# EasyEDA Pro project 2230506226.epro

# Schematic SCH

## Sheets
1 P1: Board Name: B1; Create Date: 2024-03-08; Page Name: P1; Project Name: 2230506226; Schematic Name: SCH; Update Date: 2024-04-02; Company: EDA设计与开发; Page Size: A4; Version: V1.0
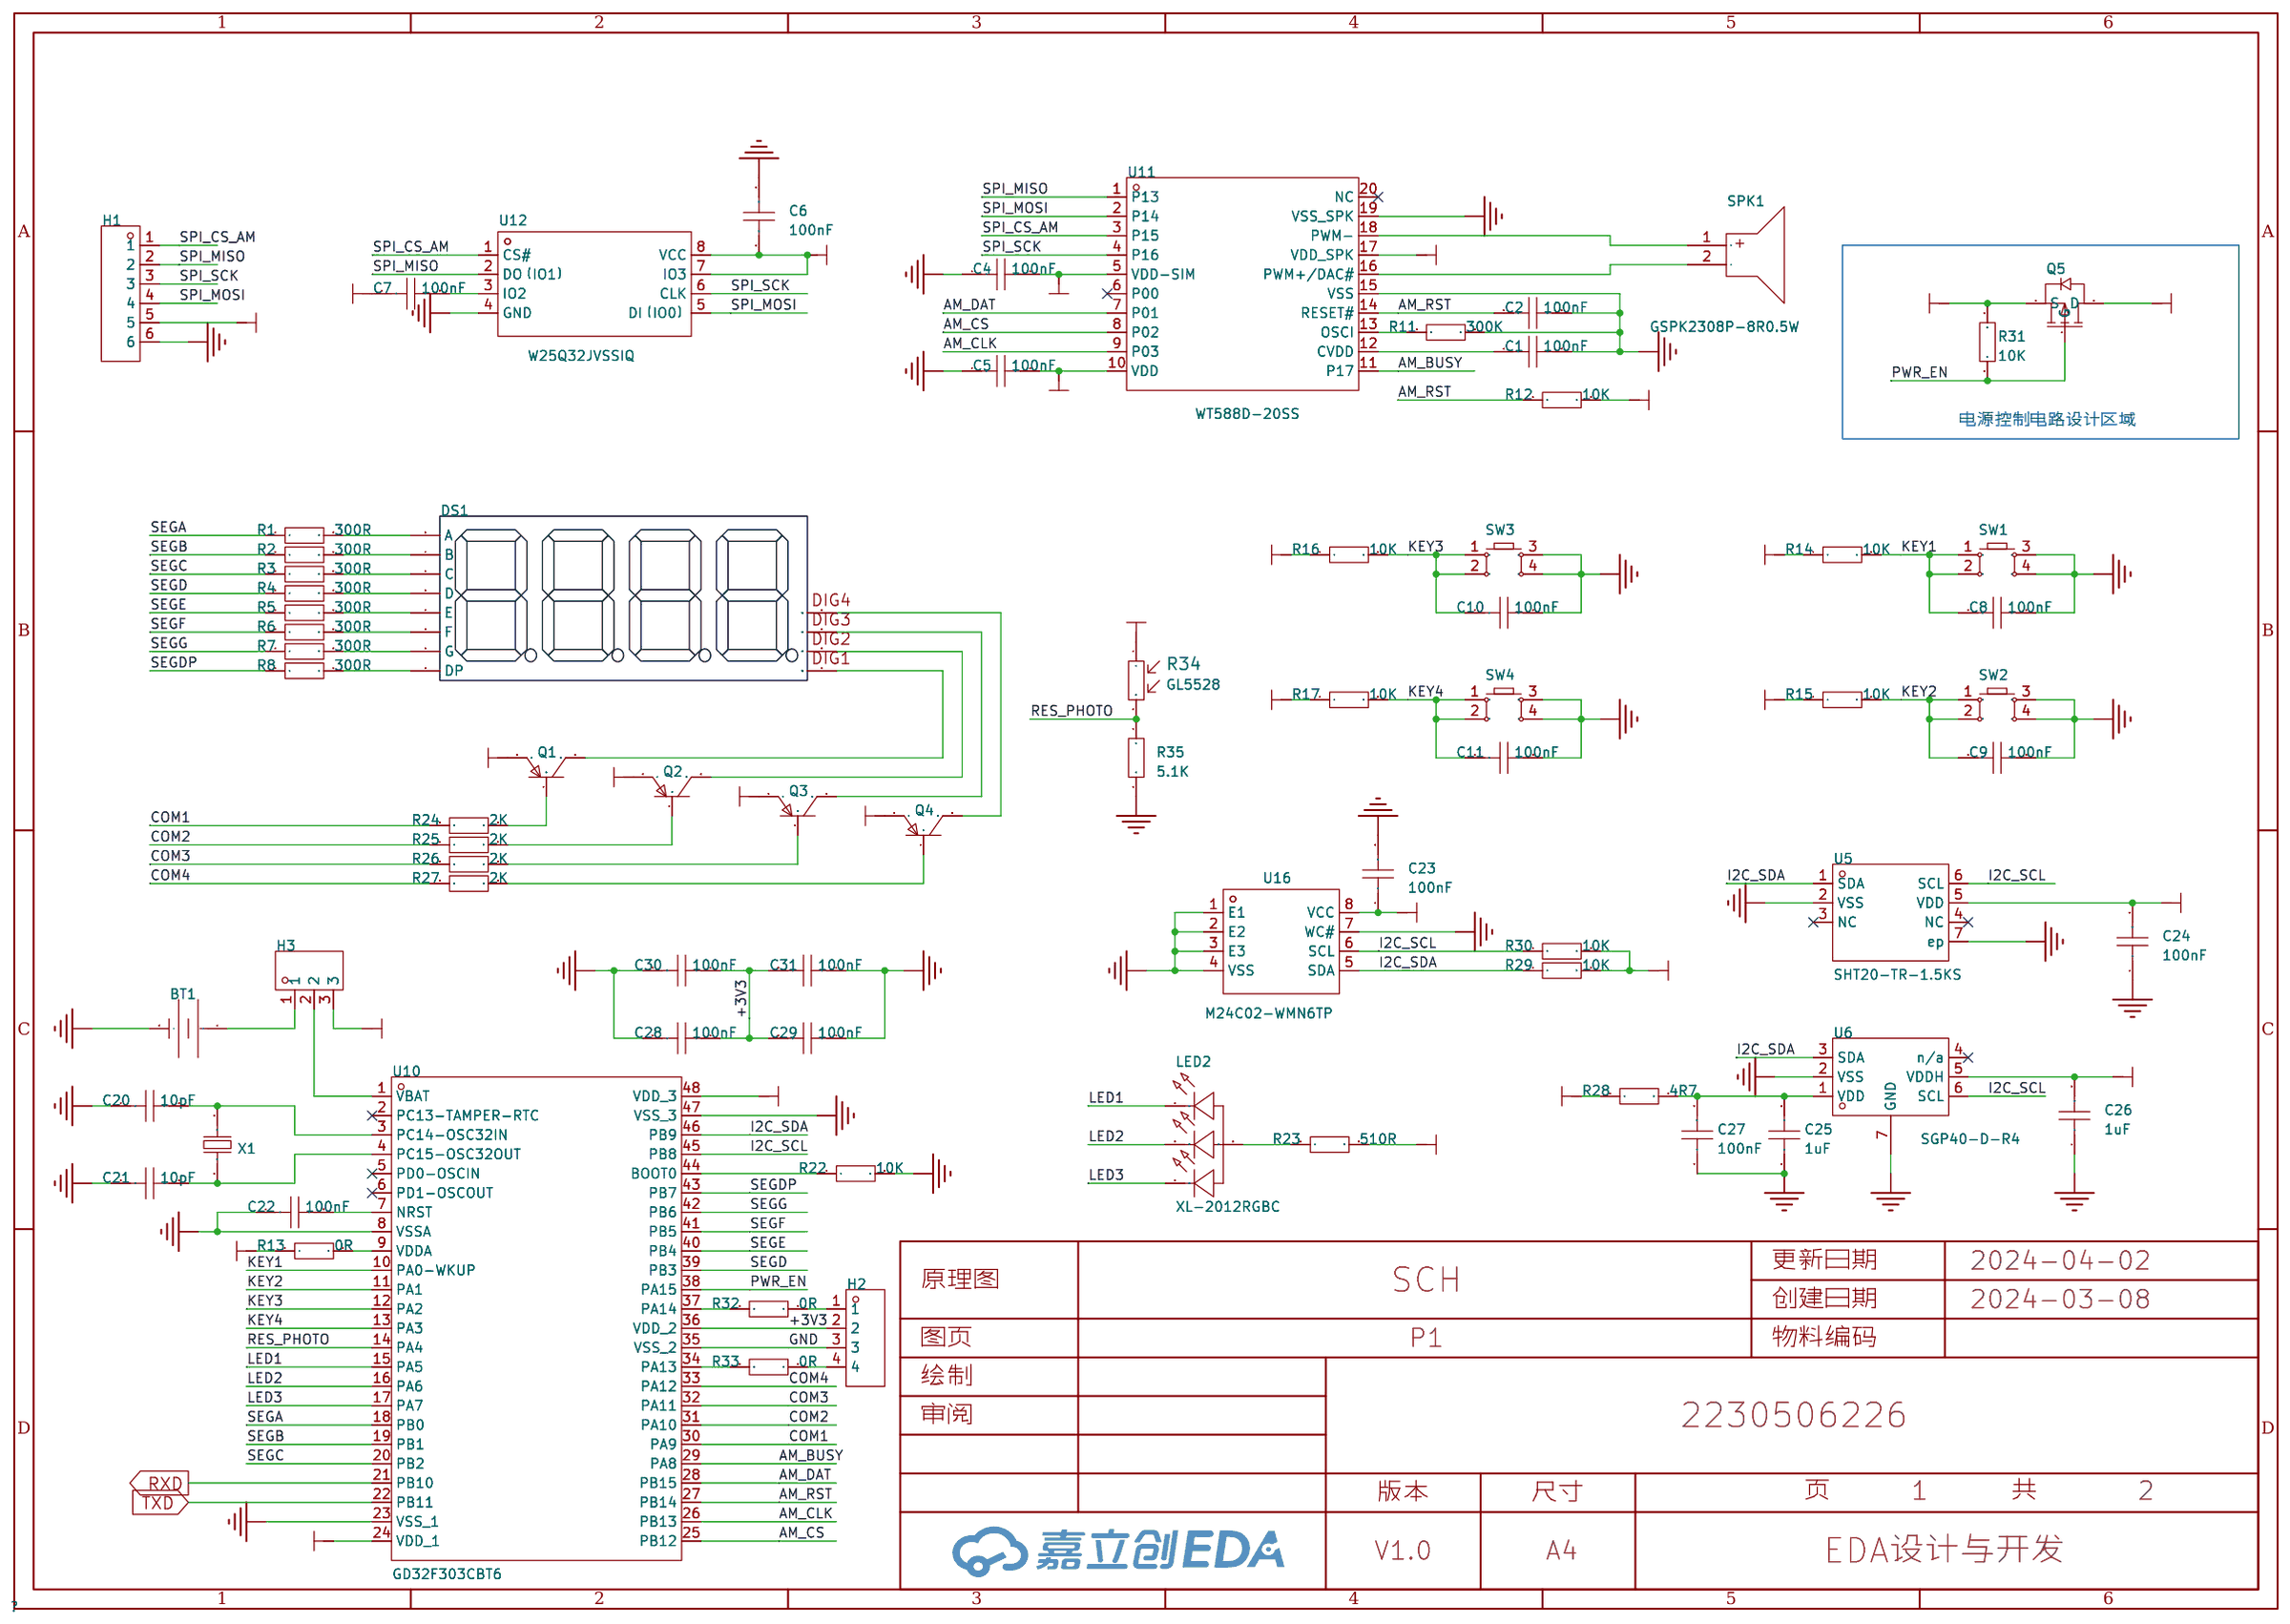
[diagram p0: P1]
2 P2: Create Date: 2024-03-12; Page Name: P2; Update Date: 2024-03-21; Company: 嘉立创EDA
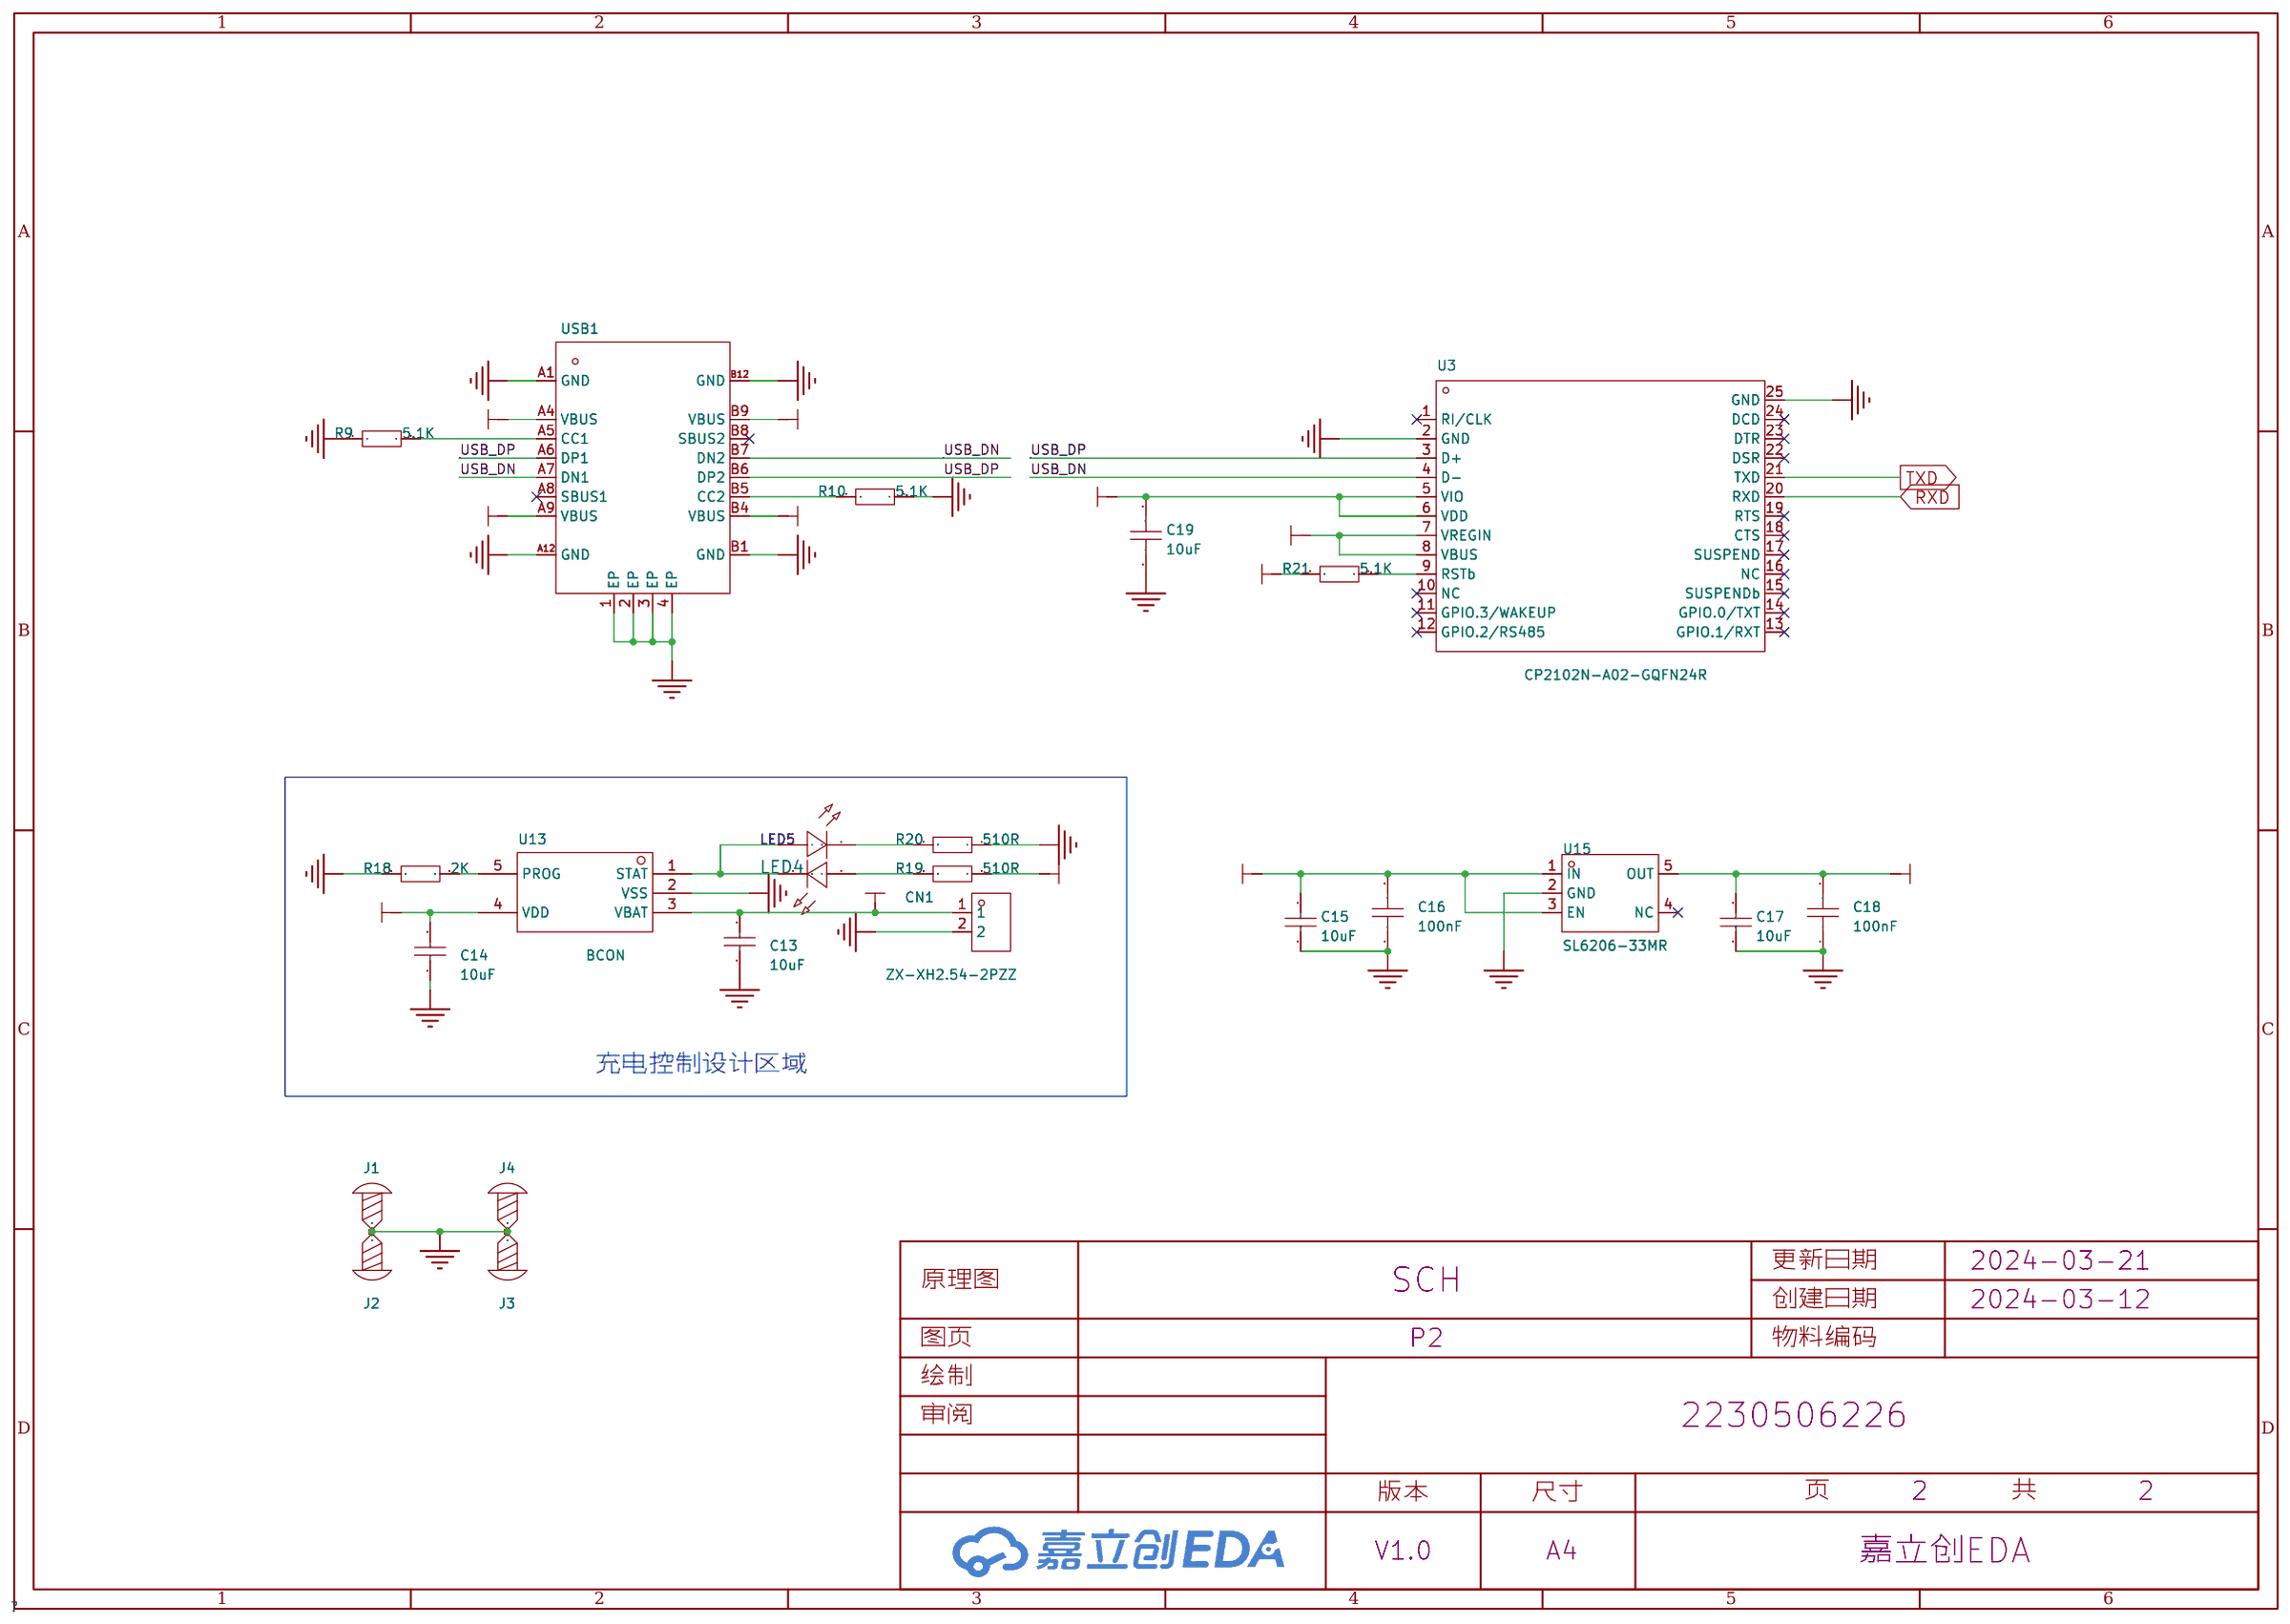
[diagram p1: P2]

## Parts
sheet P1
BT1  BS-12-B3AA003  [BAT-SMD_BS-12-B3AA011]
C1  100nF  [C0805]
C2  100nF  [C0805]
C4  100nF  [C0805]
C5  100nF  [C0805]
C6  100nF  [C0805]
C7  100nF  [C0805]
C8  100nF  [C0805]
C9  100nF  [C0805]
C10  100nF  [C0805]
C11  100nF  [C0805]
C20  10pF  [C0805]
C21  10pF  [C0805]
C22  100nF  [C0805]
C23  100nF  [C0805]
C24  100nF  [C0805]
C25  1uF  [C0805]
C26  1uF  [C0805]
C27  100nF  [C0805]
C28  100nF  [C0805]
C29  100nF  [C0805]
C30  100nF  [C0805]
C31  100nF  [C0805]
DS1  -  [LED-SEG-TH_FJ5461AH]
H1  -  [HDR-TH_6P-P2.54-V-F]
H2  -  [HDR-TH_4P-P2.54-V-F]
H3  Jumper3  [HDR-TH_3P-P2.54-V-M-A]
LED2  XL-2012RGBC  [LED-SMD_4P-L2.0-W1.3-BR]
Q1  -  [S8550P_SOT]
Q2  -  [S8550P_SOT]
Q3  -  [S8550P_SOT]
Q4  -  [S8550P_SOT]
Q5  -  [AO3401A_SOT-23-3]
R1  300R  [R0805]
R2  300R  [R0805]
R3  300R  [R0805]
R4  300R  [R0805]
R5  300R  [R0805]
R6  300R  [R0805]
R7  300R  [R0805]
R8  300R  [R0805]
R11  300K  [R0805]
R12  10K  [R0805]
R13  0R  [R0805]
R14  10K  [R0805]
R15  10K  [R0805]
R16  10K  [R0805]
R17  10K  [R0805]
R22  10K  [R0805]
R23  510R  [R0805]
R24  2K  [R0805]
R25  2K  [R0805]
R26  2K  [R0805]
R27  2K  [R0805]
R28  4R7  [R0805]
R29  10K  [R0805]
R30  10K  [R0805]
R31  10K  [R0805]
R32  0R  [R0805]
R33  0R  [R0805]
R34  GL5528  [RES-TH_L5.1-W4.3-P3.40-D0.5]
R35  5.1K  [R0805]
SPK1  GSPK2308P-8R0.5W  [SPK-TH_BD23.0-P10.00-D0.8-L-RD]
SW1  -  [Key_SMD_12x12x7.3]
SW2  -  [Key_SMD_12x12x7.3]
SW3  -  [Key_SMD_12x12x7.3]
SW4  -  [Key_SMD_12x12x7.3]
U5  SHT20-TR-1.5KS  [DFN-6_L3.0-W3.0-P0.95-TR-EP]
U6  SGP40-D-R4  [DFN-6_L2.4-W2.4-P0.80-TL-EP]
U10  GD32F303CBT6  [LQFP-48_L7.0-W7.0-P0.50-LS9.0-BL]
U11  WT588D-20SS  [SSOP-20_L7.2-W5.3-P0.65-LS7.8-BL]
U12  W25Q32JVSSIQ  [SOIC-8_L5.3-W5.3-P1.27-LS8.0-BL]
U16  M24C02-WMN6TP  [SOIC-8_L4.9-W3.9-P1.27-LS6.0-BL]
X1  32.768kHz  [FC-135R_L3.2-W1.5]
sheet P2
C13  10uF  [C1206]
C14  10uF  [C1206]
C15  10uF  [C1206]
C16  100nF  [C0805]
C17  10uF  [C1206]
C18  100nF  [C0805]
C19  10uF  [C0805]
CN1  ZX-XH2.54-2PZZ  [CONN-TH_2P-P2.50_HX25003-2A]
J1  -  [M2螺丝]
J2  -  [M2螺丝]
J3  -  [M2螺丝]
J4  -  [M2螺丝]
LED4  -  [LED_0805]
LED5  -  [LED_0805]
R9  5.1K  [R0805]
R10  5.1K  [R0805]
R18  2K  [R0805]
R19  510R  [R0805]
R20  510R  [R0805]
R21  5.1K  [R0805]
U3  CP2102N-A02-GQFN24R  [QFN-24_L4.0-W4.0-P0.50-TL-EP2.6]
U13  BCON  [SOP_BCON]
U15  SL6206-33MR  [SOT-23-5_L2.9-W1.6-P0.95-LS2.8-BL]
USB1  -  [USB_TYPE-C-16P]

## Library data of the parts
BT1 = BS-12-B3AA003: 连接器类型:电池底座;适用电池规格:CR1220;工作温度范围:-25℃~+85℃;; Supplier Part: C964723; Manufacturer: MYOUNG(美阳); Supplier Footprint: SMD; JLCPCB Part Class: 扩展库; Datasheet: https://atta.szlcsc.com/upload/public/pdf/source/20201218/C964723_733B638E287393F86295A2A4DAE43C75.pdf; Supplier: LCSC; Connector Type: 电池底座; Battery Type: CR1220; Operating Temperature Range: -25℃~+85℃
C1 C2 C4-C11 C16 C18-C31 = CAP_0805: Supplier Footprint: 0805
DS1 = LED_SEG_TH_0.56x4: Supplier Footprint: 插件
H1 = HDR-F_2.54_1x6P: Supplier Part: C40877; Supplier Footprint: 插件
H2 = HDR-F_2.54_1x4P: Supplier Part: C2718488; Supplier Footprint: 插件
H3 = Jumper3: Supplier Part: C2940050; Supplier Footprint: HDR-TH-3P-2.54mm; JLCPCB Part Class: 扩展库; Supplier: LCSC
LED2 = XL-2012RGBC: 发光颜色:RGB三色;功率:80mW；80mW；55mW;正向电流:25mA;主波长:619nm~624nm；463nm~466nm；524nm~527nm;二极管配置:-;透镜颜色:无色透明透镜;色温:-;发光角度:120°;载带方式:正贴;工作温度:-30℃~+85℃;; Supplier Part: C965848; Manufacturer: XINGLIGHT(成兴光); Supplier Footprint: 0805; JLCPCB Part Class: 扩展库; Datasheet: https://atta.szlcsc.com/upload/public/pdf/source/20221102/35E310354F68AE1BCFC07B93F5E395D6.pdf; Supplier: LCSC; Emitted Color: RGB三色; Power Dissipation: 80mW；80mW；55mW; Forward Current: 25mA; Dominant Wavelength: 619nm~624nm；463nm~466nm；524nm~527nm; Peak Wavelength: 624nm；528nm；469nm; Lens Color: 无色透明透镜; Viewing Angle: 120°; Mounting Sytle: 正贴; Operating Temperature: -30℃~+85℃
Q1-Q4 = S8550_SOT_PNP: Supplier Footprint: SOT-23
Q5 = AO3401A_P: Supplier Footprint: SOT-23-3L; Supplier Part: C15127
R1-R33 R35 = Res_0805: Supplier Footprint: 0805
R34 = GL5528: 暗电阻:1MΩ;亮电阻 @ 10Lux:8kΩ~20kΩ;光谱峰值(波长):540nm;; LCSC Part Name: 亮电阻:8kΩ~20kΩ 暗电阻:1MΩ; Supplier Part: C125627; Manufacturer: 森霸; Supplier Footprint: 插件,P=3mm; JLCPCB Part Class: 扩展库; Datasheet: https://atta.szlcsc.com/upload/public/pdf/source/20230427/842A99E3D53A83729D7968886D4EFCBB.pdf; Supplier: LCSC; Dark Resistance: 1MΩ; Illuminated Resistance @ 10Lux: 8kΩ~20kΩ; Applied Voltage: 150V; Spectral Peak: 540nm
SPK1 = GSPK2308P-8R0.5W: Supplier Part: C530532; Manufacturer: INGHAi(赢海); JLCPCB Part Class: 扩展库; Datasheet: https://atta.szlcsc.com/upload/public/pdf/source/20200723/C530532_3DB1F973601B36F20FBCCA52751811A3.pdf; Supplier: LCSC
SW1-SW4 = Key_SMD_12x12x7.3: Supplier Footprint: SMD
U5 = SHT20-TR-1.5KS: 接口类型:I2C;; LCSC Part Name: 1-100706-01; Supplier Part: C53865; Manufacturer: Sensirion(瑞士盛思锐); Supplier Footprint: DFN-6-EP(3x3); JLCPCB Part Class: 扩展库; Datasheet: https://atta.szlcsc.com/upload/public/pdf/source/20151012/1457707445424.pdf; Supplier: LCSC; Interface Type: I2C; Supply Voltage: 2.1V~3.6V
U6 = SGP40-D-R4: 气体类型:空气质量;精度:-;; LCSC Part Name: 3.000.384; Supplier Part: C2874215; Manufacturer: Sensirion(瑞士盛思锐); Supplier Footprint: DFN-6-EP(2.4x2.4); JLCPCB Part Class: 扩展库; Datasheet: https://atta.szlcsc.com/upload/public/pdf/source/20231011/67A6038984BE66B07B1FF2325C50691F.pdf; Supplier: LCSC; Type: 空气质量; Operating Temperature: -10℃~+50℃
U10 = GD32F303CBT6_C3013779: CPU内核:CM4;程序存储容量:128KB;RAM总容量:32KB;GPIO端口数量:37;工作电压范围:-;CPU最大主频:120MHz;程序存储器类型:FLASH;; Supplier Part: C3013779; Manufacturer: GigaDevice(兆易创新); Supplier Footprint: LQFP-48(7x7); JLCPCB Part Class: 扩展库; Datasheet: https://atta.szlcsc.com/upload/public/pdf/source/20220624/E1A57ED816B162D6D1424864911A792F.pdf; Supplier: LCSC; CPU Core: CM4; Program Storage Size: 128KB; RAM Size: 32KB; GPIO Ports Number: 37; CPU Maximum Speed: 120MHz; Program Memory Type: FLASH; ADC (Bit): 12bit; DAC (Bit): 12bit; 16Bit Timer: 7; CAN: 1; UART/USART: 3; I2C: 2; I2S: 2; SPI: 3; Peripheral/Function: 看门狗；RTC实时时钟; Watchdog: 有; Real-Time Clock: 有
U11 = WT588D-20SS: 高品质语音芯片; Supplier Part: C87498; Manufacturer: WT(唯创知音); Supplier Footprint: SSOP-20-208mil; JLCPCB Part Class: 扩展库; Datasheet: https://atta.szlcsc.com/upload/public/pdf/source/20161217/1481939141189.pdf; Supplier: LCSC
U12 = W25Q32JVSSIQ_C82344: 接口类型:SPI;存储容量:32Mbit;; Supplier Part: C82344; Manufacturer: WINBOND(华邦); Supplier Footprint: SOIC-8-208mil; JLCPCB Part Class: 扩展库; Datasheet: https://atta.szlcsc.com/upload/public/pdf/source/20160910/1473490310454.pdf; Supplier: LCSC; Interface Type: SPI; Memory Size: 32Mbit; Supply Voltage: 2.7V~3.6V; Page Programming Time (Tpp): 3ms; Operating Temperature: -40℃~+85℃
U16 = M24C02-WMN6TP: 接口类型:I2C;存储容量:2Kbit;; Supplier Part: C7562; Manufacturer: ST(意法半导体); Supplier Footprint: SOIC-8; JLCPCB Part Class: Extended Part; Datasheet: https://atta.szlcsc.com/upload/public/pdf/source/20140724/1457707167301.pdf; Supplier: LCSC; Interface Type: I2C; Memory Size: 2Kbit; Supply Voltage: 2.5V~5.5V; Operating Temperature: -40℃~+85℃
X1 = Q13FC13500004_C32346: 晶振类型:贴片晶振;频率:32.768kHz;常温频差:±20ppm;外接负载电容:12.5pF;; LCSC Part Name: 32.768kHz ±20ppm 12.5pF; Supplier Part: C32346; Manufacturer: EPSON(爱普生); Manufacturer Part: Q13FC13500004; Supplier Footprint: SMD3215-2P; JLCPCB Part Class: 基础库; Datasheet: https://atta.szlcsc.com/upload/public/pdf/source/20190108/C32346_746D6B07EAF90824457A96480007685F.pdf; Supplier: LCSC; Crystal Type: 贴片晶振; Normal temperature Frequency Tolerance: ±20ppm; External load capacitor: 12.5pF; Equivalent Series Resistance (ESR): 70kΩ; Operating Temperature: -40℃~+85℃
C13-C15 C17 = CL31A106KBHNNNE: 容值:10uF;精度:±10%;额定电压:50V;材质(温度系数):X5R;; LCSC Part Name: 10uF ±10% 50V; Supplier Part: C13585; Manufacturer: SAMSUNG(三星); Supplier Footprint: 1206; JLCPCB Part Class: 基础库; Datasheet: https://atta.szlcsc.com/upload/public/pdf/source/20160218/1457707763339.pdf; Supplier: LCSC; Tolerance: ±10%; Voltage Rated: 50V; Temperature Coefficient: X5R
CN1 = ZX-XH2.54-2PZZ: 插针结构:1x2P;间距:2.54mm;安装方式:直插;参考系列:XH;总PIN数:2P;排数:1;每排PIN数:2;行距:-;额定电流:3A;触头材质:黄铜;触头镀层:锡;工作温度范围:-25℃~+85℃;; Supplier Part: C7429632; Manufacturer: Megastar(兆星); Supplier Footprint: 插件,P=2.54mm; JLCPCB Part Class: 扩展库; Datasheet: https://atta.szlcsc.com/upload/public/pdf/source/20230619/19BA6947230AA44A04D3EDD65E618FD0.pdf; Supplier: LCSC; Pins Structure: 1x2P; Pitch: 2.54mm; Mounting Style: 直插; Reference Series: XH; Number of Pins: 2P; Number of Rows: 1; Number of PINs Per Row: 2; Current Rating (Max): 3A; Contact Material: 黄铜; Contact Plating: 锡; Operating Temperature Range: -25℃~+85℃
J1-J4 = M2螺丝: Supplier Footprint: 插件
LED4 = LED_0805-R: Supplier Footprint: 0805
LED5 = LED_0805-G: Supplier Footprint: 0805
U3 = CP2102N-A02-GQFN24R: 应用功能:USB转UART;接口协议:UART;; Supplier Part: C969151; Manufacturer: SKYWORKS/SILICON LABS(芯科); Supplier Footprint: QFN-24-EP(4x4); JLCPCB Part Class: 扩展库; Datasheet: https://atta.szlcsc.com/upload/public/pdf/source/20201204/C964632_F2B790CC23A72455AEF523510305B30A.pdf; Supplier: LCSC; Applications Function: USB转UART; Protocol: UART; Supply Voltage: 3V~3.6V; Operating Temperature: -40℃~+85℃@(Ta)
U13 = BCON
U15 = SL6206-33MR: 输出类型:-;; Supplier Part: C707122; Manufacturer: Slkor(萨科微); Supplier Footprint: SOT-23-5; JLCPCB Part Class: 扩展库; Datasheet: https://atta.szlcsc.com/upload/public/pdf/source/20200721/C707121_33633D17E61D5DC97F22208BE63A0FB1.pdf; Supplier: LCSC
USB1 = USB_TYPE-C-16P: Supplier Footprint: SMD

## Nets
+3V3: C4.2 C5.2 C6.2 C7.1 C17.2 C18.2 C19.2 C23.1 C28.1 C29.2 C30.1 C31.2 H1.5 H2.2 H3.3 Q1.2(E) Q2.2(E) Q3.2(E) Q4.2(E) Q5.2(S) R12.2 R13.1 R14.1 R15.1 R16.1 R17.1 R21.2 R23.2 R29.2 R30.2 R31.1 R34.1 U3.5(VIO) U3.6(VDD) U10.24(VDD_1) U10.36(VDD_2) U10.48(VDD_3) U11.5(VDD-SIM) U11.10(VDD) U11.17(VDD_SPK) U12.7(IO3) U12.8(VCC) U15.5(OUT) U16.8(VCC)
GND: BT1.2(-) C1.2 C2.2 C4.1 C5.1 C6.1 C8.2 C9.2 C10.2 C11.2 C13.2 C14.2 C15.1 C16.1 C17.1 C18.1 C19.1 C20.1 C21.1 C22.1 C23.2 C24.1 C25.1 C26.1 C27.1 C28.2 C29.1 C30.2 C31.1 CN1.2 H1.6 H2.3 J1.1 J2.1 J3.1 J4.1 R9.1 R10.1 R11.2 R18.2 R20.1 R22.2 R35.2 SW1.3 SW1.4 SW2.3 SW2.4 SW3.3 SW3.4 SW4.3 SW4.4 U3.2(GND) U3.25(GND) U5.2(VSS) U5.7(ep) U6.2(VSS) U6.7(GND) U10.8(VSSA) U10.23(VSS_1) U10.35(VSS_2) U10.47(VSS_3) U11.15(VSS) U11.19(VSS_SPK) U12.4(GND) U13.2(VSS) U15.2(GND) U16.1(E1) U16.2(E2) U16.3(E3) U16.4(VSS) U16.7(WC#) USB1.1(EP) USB1.2(EP) USB1.3(EP) USB1.4(EP) USB1.A1(GND) USB1.A12(GND) USB1.B1(GND) USB1.B12(GND)
VBAT: C13.1 C15.2 C16.2 CN1.1 U13.3(VBAT) U15.1(IN) U15.3(EN)
VBUS: C14.1 R19.1 U3.7(VREGIN) U3.8(VBUS) U13.4(VDD) USB1.A4(VBUS) USB1.A9(VBUS) USB1.B4(VBUS) USB1.B9(VBUS)
+VS: C24.2 C26.2 Q5.3(D) R28.1 U5.5(VDD) U6.5(VDDH)
AM_BUSY: U10.29(PA8) U11.11(P17)
AM_CLK: U10.26(PB13) U11.9(P03)
AM_CS: U10.25(PB12) U11.8(P02)
AM_DAT: U10.28(PB15) U11.7(P01)
AM_RST: C2.1 R12.1 U10.27(PB14) U11.14(RESET#)
COM1: R24.1 U10.30(PA9)
COM2: R25.1 U10.31(PA10)
COM3: R26.1 U10.32(PA11)
COM4: R27.1 U10.33(PA12)
I2C_SCL: R30.1 U5.6(SCL) U6.6(SCL) U10.45(PB8) U16.6(SCL)
I2C_SDA: R29.1 U5.1(SDA) U6.3(SDA) U10.46(PB9) U16.5(SDA)
KEY1: C8.1 R14.2 SW1.1 SW1.2 U10.10(PA0-WKUP)
KEY2: C9.1 R15.2 SW2.1 SW2.2 U10.11(PA1)
KEY3: C10.1 R16.2 SW3.1 SW3.2 U10.12(PA2)
KEY4: C11.1 R17.2 SW4.1 SW4.2 U10.13(PA3)
LED1: LED2.1 U10.15(PA5)
LED2: LED2.2 U10.16(PA6)
LED3: LED2.4 U10.17(PA7)
PWR_EN: Q5.1(G) R31.2 U10.38(PA15)
RES_PHOTO: R34.2 R35.1 U10.14(PA4)
RXD: U3.20(RXD) U10.21(PB10)
SEGA: R1.1 U10.18(PB0)
SEGB: R2.1 U10.19(PB1)
SEGC: R3.1 U10.20(PB2)
SEGD: R4.1 U10.39(PB3)
SEGDP: R8.1 U10.43(PB7)
SEGE: R5.1 U10.40(PB4)
SEGF: R6.1 U10.41(PB5)
SEGG: R7.1 U10.42(PB6)
SPI_CS_AM: H1.1 U11.3(P15) U12.1(CS#)
SPI_MISO: H1.2 U11.1(P13) U12.2(DO（IO1）)
SPI_MOSI: H1.4 U11.2(P14) U12.5(DI（IO0）)
SPI_SCK: H1.3 U11.4(P16) U12.6(CLK)
TXD: U3.21(TXD) U10.22(PB11)
USB_DN: U3.4(D-) USB1.A7(DN1) USB1.B7(DN2)
USB_DP: U3.3(D+) USB1.A6(DP1) USB1.B6(DP2)
$1N1449: DS1.8(DIG3) Q3.3(C)
$1N1467: DS1.1(E) R5.2
$1N1471: DS1.2(D) R4.2
$1N1475: DS1.3(DP) R8.2
$1N1479: DS1.4(C) R3.2
$1N1483: DS1.5(G) R7.2
$1N1487: DS1.11(A) R1.2
$1N1491: DS1.7(B) R2.2
$1N1495: DS1.10(F) R6.2
$1N6161: C1.1 U11.12(CVDD)
$1N6192: R11.1 U11.13(OSCI)
$1N6375: SPK1.1(+) U11.18(PWM-)
$1N6384: SPK1.2(-) U11.16(PWM+/DAC#)
$1N6917: C7.2 U12.3(IO2)
$1N7212: R13.2 U10.9(VDDA)
$1N7925: C20.2 U10.3(PC14-OSC32IN) X1.1
$1N7930: C21.2 U10.4(PC15-OSC32OUT) X1.2
$1N8028: R22.1 U10.44(BOOT0)
$1N8104: LED2.3 R23.1
$1N8256: DS1.12(DIG1) Q1.3(C)
$1N8335: DS1.9(DIG2) Q2.3(C)
$1N8343: DS1.6(DIG4) Q4.3(C)
$1N8477: Q1.1(B) R24.2
$1N8481: Q2.1(B) R25.2
$1N8485: Q3.1(B) R26.2
$1N8489: Q4.1(B) R27.2
$1N8598: C22.2 U10.7(NRST)
$1N9384: C25.2 C27.2 R28.2 U6.1(VDD)
$1N9794: R32.1 U10.37(PA14)
$1N9795: H2.1 R32.2
$1N9824: R33.1 U10.34(PA13)
$1N9825: H2.4 R33.2
$1N10132: BT1.1(+) H3.1
$1N10135: H3.2 U10.1(VBAT)
$2N394: R9.2 USB1.A5(CC1)
$2N397: R10.2 USB1.B5(CC2)
$2N1836: R21.1 U3.9(RSTb)
$2N6275: LED4.2(A) R19.2
$2N6277: LED5.1(C) R20.2
$2N6369: LED4.1(C) LED5.2(A) U13.1(STAT)
$2N6547: R18.1 U13.5(PROG)

Not connected (* = marked no-connect by the designer): U3 1(RI/CLK)* 10(NC)* 11(GPIO.3/WAKEUP)* 12(GPIO.2/RS485)* 13(GPIO.1/RXT)* 14(GPIO.0/TXT)* 15(SUSPENDb)* 16(NC)* 17(SUSPEND)* 18(CTS)* 19(RTS)* 22(DSR)* 23(DTR)* 24(DCD)*; U5 3(NC)* 4(NC)*; U6 4(n/a)*; U10 2(PC13-TAMPER-RTC)* 5(PD0-OSCIN)* 6(PD1-OSCOUT)*; U11 6(P00)* 20(NC)*; U15 4(NC)*; USB1 A8(SBUS1)* B8(SBUS2)*

## Notes on the sheets
sheet 1
- 电源控制电路设计区域
sheet 2
- 充电控制设计区域

# Board PCB
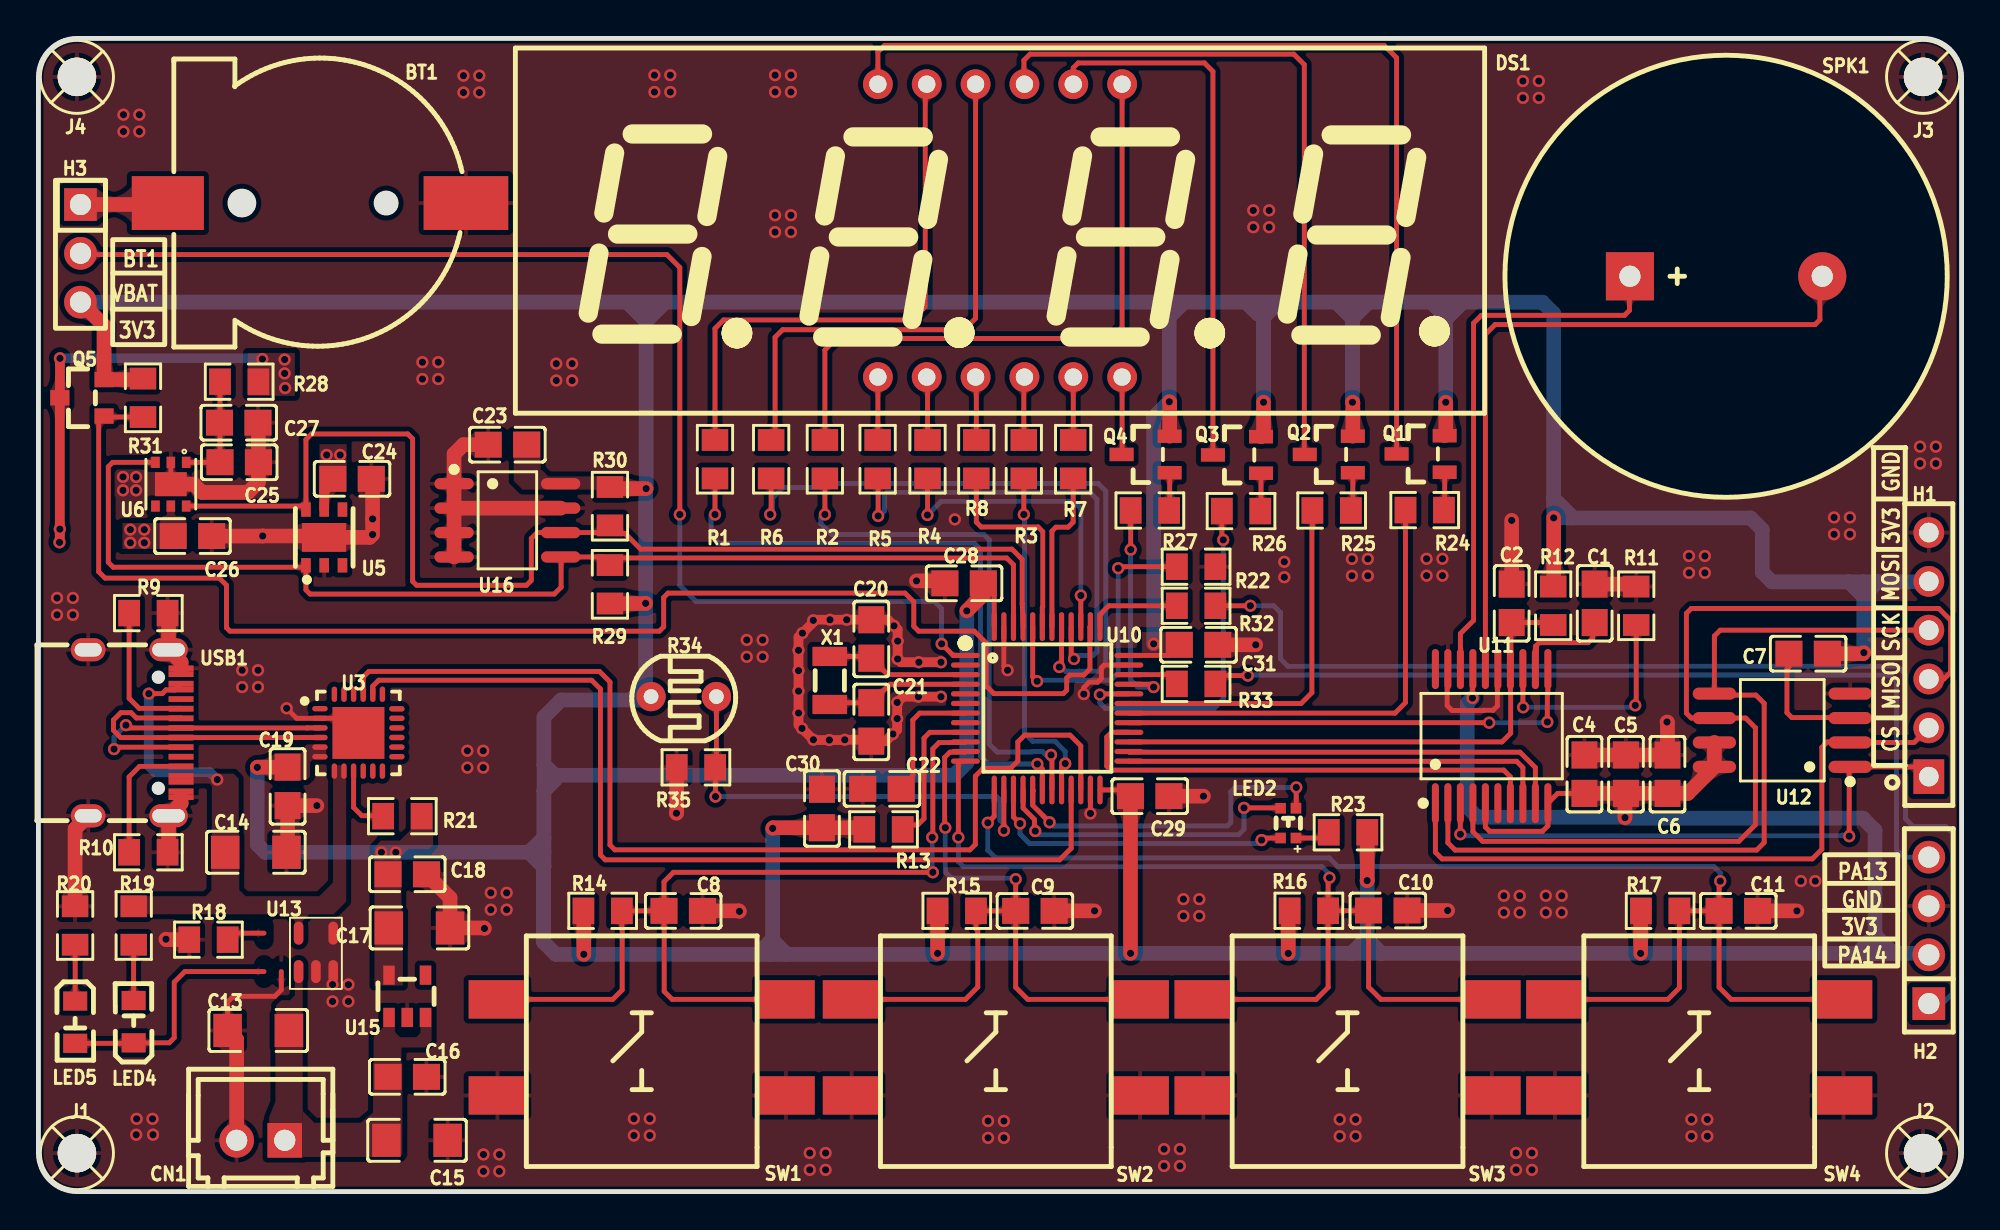
[diagram p2: board, top side]
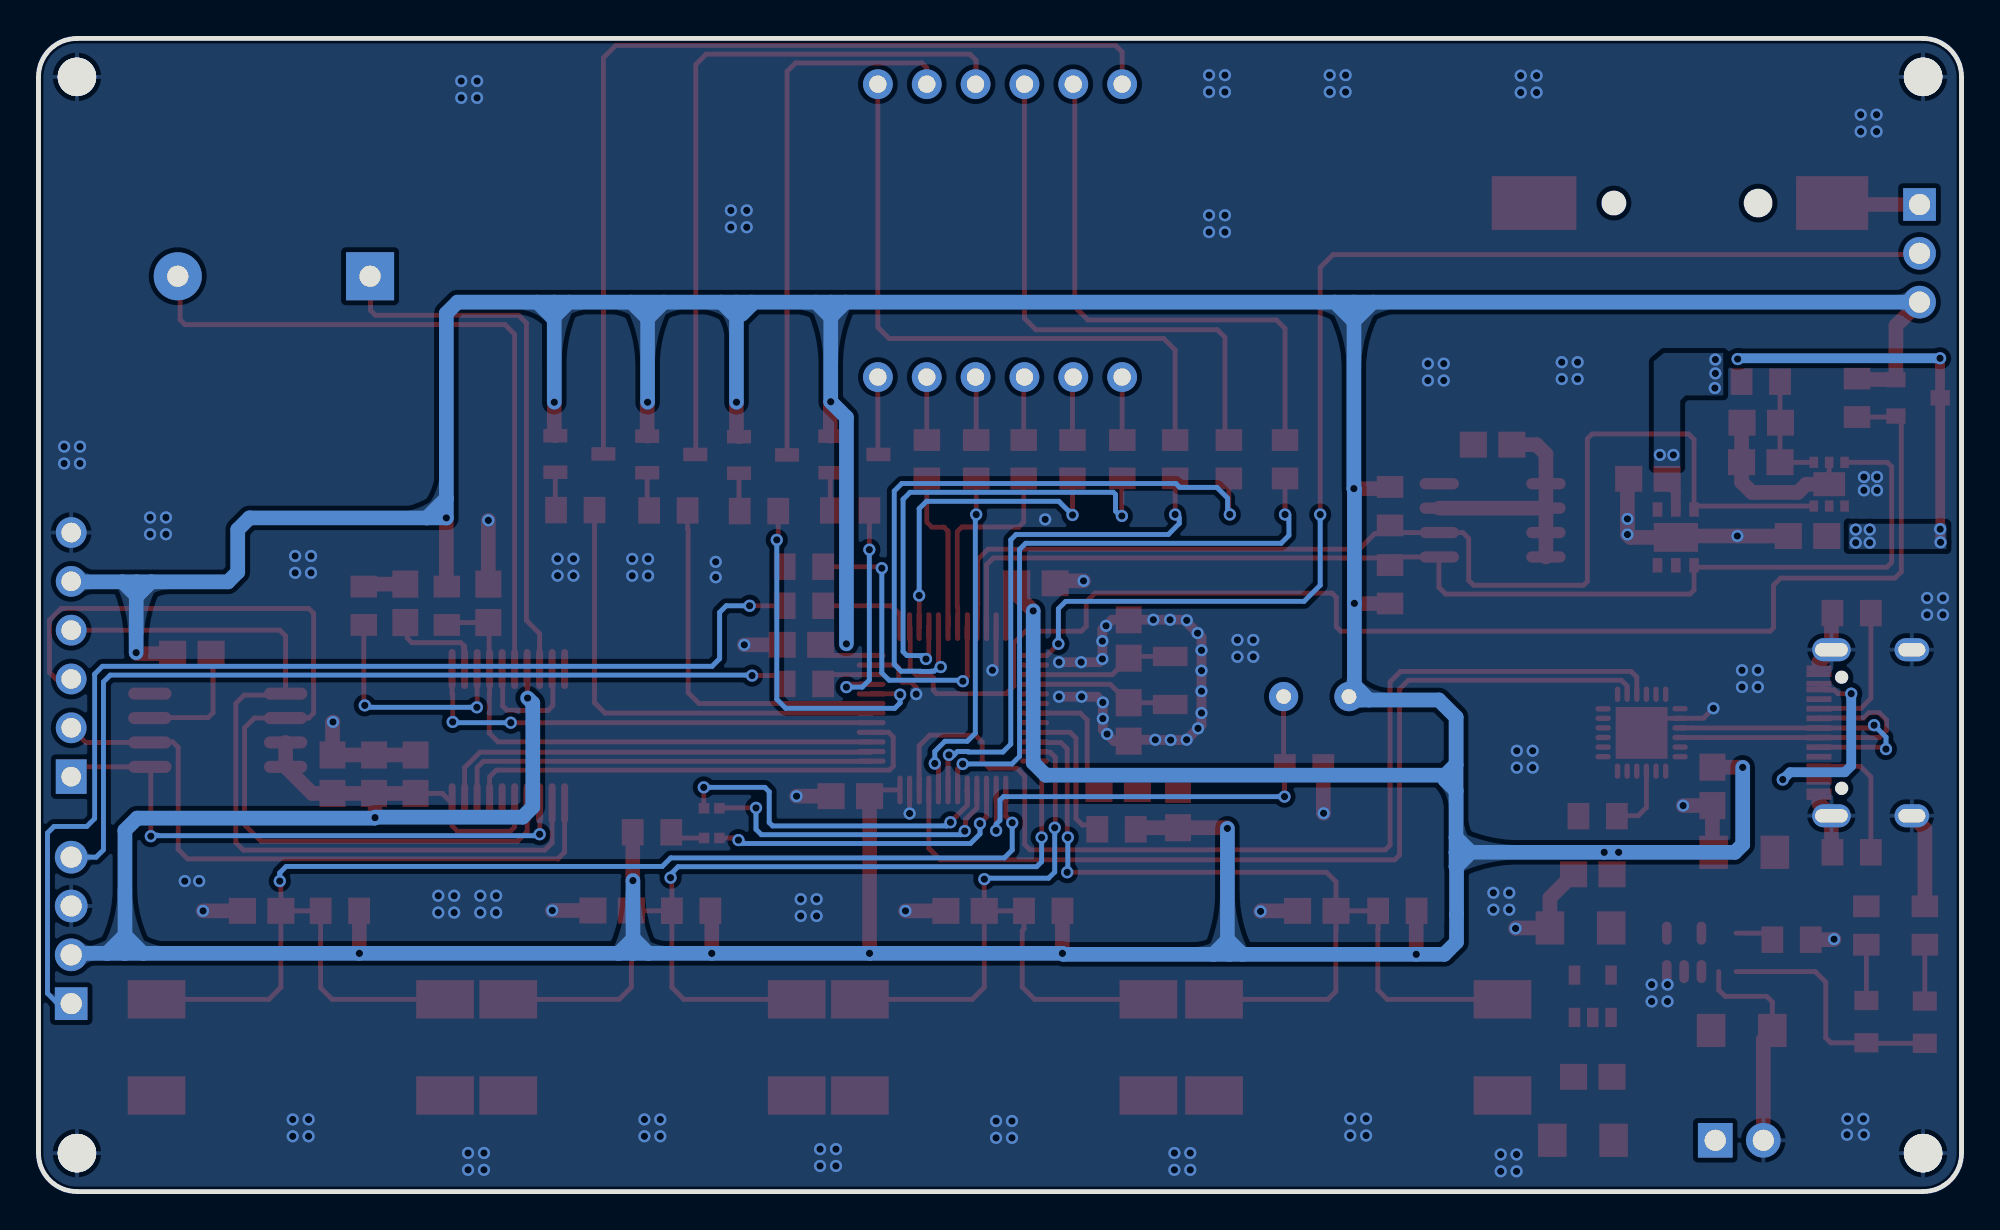
[diagram p3: board, bottom side, seen from below]

Outline 100 x 60 mm; copper layers: Top Layer, Bottom Layer. Coordinates in mm from the lower left corner of the outline.
Outline path: 0,58 0,2 arc(0.59,0.59) 2,0 98,0 arc(99.41,0.59) 100,2 100,58 arc(99.41,59.41) 98,60 2,60 arc(0.59,59.41) 0,58
Stack: Top Layer 0.035mm / Dielectric1 1.51mm FR4 er 4.5 / Bottom Layer 0.035mm

## Design rules (mm)
net +3V3: PWR
net VBAT: PWR
net VBUS: PWR
net $1N7925: 晶振
net $1N7930: 晶振
net +VS: PWR
net USB_DP: USB
net USB_DN: USB
template: 自定义配置
spacing copperThickness1oz (default): track to track 0.203, other pairs 0.178 to 0.203
track width signal (default): min 0.254, default 0.254, max 2.54
track width PWR: min 0.254, default 0.762, max 2.54
differential pair differentialPair (default): width min 0.127, default 0.254, max 2.54; gap min 0.152, default 0.152
via viaSize (default): diameter min 0.635, default 0.635, max 10; hole min 0.381, default 0.381, max 6.299
net class PWR uses PWR
net +3V3 uses PWR
net VBAT uses PWR
net VBUS uses PWR
net +VS uses PWR

## Placement (name value [footprint] x y rotation side)
BT1  BS-12-B3AA003  [BAT-SMD_BS-12-B3AA011]  14.48 51.44 180 top
C1  100nF  [C0805]  80.92 30.61 90 top
C2  100nF  [C0805]  76.61 30.61 90 top
C4  100nF  [C0805]  80.39 21.72 270 top
C5  100nF  [C0805]  82.55 21.72 270 top
C6  100nF  [C0805]  84.71 21.72 270 top
C7  100nF  [C0805]  92.02 27.99 180 top
C8  100nF  [C0805]  33.53 14.61 0 top
C9  100nF  [C0805]  51.82 14.61 0 top
C10  100nF  [C0805]  70.17 14.62 0 top
C11  100nF  [C0805]  88.39 14.61 0 top
C13  10uF  [C1206]  11.43 8.38 180 top
C14  10uF  [C1206]  11.3 17.65 0 top
C15  10uF  [C1206]  19.69 2.67 180 top
C16  100nF  [C0805]  19.18 5.97 180 top
C17  10uF  [C1206]  19.81 13.72 180 top
C18  100nF  [C0805]  19.18 16.51 180 top
C19  10uF  [C0805]  12.95 21.08 90 top
C20  10pF  [C0805]  43.31 28.75 270 top
C21  10pF  [C0805]  43.31 24.44 90 top
C22  100nF  [C0805]  43.86 20.95 0 top
C23  100nF  [C0805]  24.38 38.86 180 top
C24  100nF  [C0805]  16.31 37.08 180 top
C25  1uF  [C0805]  10.44 37.95 180 top
C26  1uF  [C0805]  8.01 34.11 180 top
C27  100nF  [C0805]  10.41 40 180 top
C28  100nF  [C0805]  48.13 31.65 180 top
C29  100nF  [C0805]  57.78 20.57 180 top
C30  100nF  [C0805]  40.74 19.93 90 top
C31  100nF  [C0805]  60.32 28.45 180 top
CN1  ZX-XH2.54-2PZZ  [CONN-TH_2P-P2.50_HX25003-2A]  11.56 2.67 180 top
DS1  -  [LED-SEG-TH_FJ5461AH]  50 50 0 top
H1  -  [HDR-TH_6P-P2.54-V-F]  98.3 27.94 90 top
H2  -  [HDR-TH_4P-P2.54-V-F]  98.3 13.59 90 top
H3  Jumper3  [HDR-TH_3P-P2.54-V-M-A]  2.18 48.82 270 top
J1  -  [M2螺丝]  2 2 0 top
J2  -  [M2螺丝]  98 2 0 top
J3  -  [M2螺丝]  98 58 0 top
J4  -  [M2螺丝]  2 58 0 top
LED2  XL-2012RGBC  [LED-SMD_4P-L2.0-W1.3-BR]  64.99 19.17 270 top
LED4  -  [LED_0805]  4.95 8.89 90 top
LED5  -  [LED_0805]  1.91 8.76 270 top
Q1  -  [S8550P_SOT]  71.83 38.38 0 top
Q2  -  [S8550P_SOT]  67.06 38.35 0 top
Q3  -  [S8550P_SOT]  62.28 38.33 0 top
Q4  -  [S8550P_SOT]  57.53 38.35 0 top
Q5  -  [AO3401A_SOT-23-3]  2.26 41.3 0 top
R1  300R  [R0805]  35.18 38.11 90 top
R2  300R  [R0805]  40.89 38.11 90 top
R3  300R  [R0805]  51.24 38.11 90 top
R4  300R  [R0805]  46.23 38.11 90 top
R5  300R  [R0805]  43.64 38.11 90 top
R6  300R  [R0805]  38.1 38.11 90 top
R7  300R  [R0805]  53.8 38.11 90 top
R8  300R  [R0805]  48.77 38.11 90 top
R9  5.1K  [R0805]  5.72 30.1 180 top
R10  5.1K  [R0805]  5.72 17.65 180 top
R11  300K  [R0805]  83.08 30.48 90 top
R12  10K  [R0805]  78.77 30.48 90 top
R13  0R  [R0805]  43.94 18.85 0 top
R14  10K  [R0805]  29.34 14.61 0 top
R15  10K  [R0805]  47.75 14.61 0 top
R16  10K  [R0805]  66.06 14.61 0 top
R17  10K  [R0805]  84.33 14.61 0 top
R18  2K  [R0805]  8.84 13.11 180 top
R19  510R  [R0805]  4.95 13.84 270 top
R20  510R  [R0805]  1.91 13.84 270 top
R21  5.1K  [R0805]  18.92 19.53 0 top
R22  10K  [R0805]  60.2 32.51 0 top
R23  510R  [R0805]  68.1 18.69 0 top
R24  2K  [R0805]  72.09 35.46 0 top
R25  2K  [R0805]  67.24 35.44 0 top
R26  2K  [R0805]  62.53 35.41 0 top
R27  2K  [R0805]  57.79 35.44 0 top
R28  4R7  [R0805]  10.44 42.14 180 top
R29  10K  [R0805]  29.72 31.6 270 top
R30  10K  [R0805]  29.72 35.66 90 top
R31  10K  [R0805]  5.44 41.3 270 top
R32  0R  [R0805]  60.2 30.48 0 top
R33  0R  [R0805]  60.2 26.42 0 top
R34  GL5528  [RES-TH_L5.1-W4.3-P3.40-D0.5]  33.55 25.76 90 top
R35  5.1K  [R0805]  34.19 22.07 180 top
SPK1  GSPK2308P-8R0.5W  [SPK-TH_BD23.0-P10.00-D0.8-L-RD]  87.76 47.62 0 top
SW1  -  [Key_SMD_12x12x7.3]  31.37 7.5 180 top
SW2  -  [Key_SMD_12x12x7.3]  49.78 7.5 180 top
SW3  -  [Key_SMD_12x12x7.3]  68.07 7.5 180 top
SW4  -  [Key_SMD_12x12x7.3]  86.36 7.5 180 top
U3  CP2102N-A02-GQFN24R  [QFN-24_L4.0-W4.0-P0.50-TL-EP2.6]  16.64 23.88 0 top
U5  SHT20-TR-1.5KS  [DFN-6_L3.0-W3.0-P0.95-TR-EP]  14.86 34.04 180 top
U6  SGP40-D-R4  [DFN-6_L2.4-W2.4-P0.80-TL-EP]  6.88 36.81 270 top
U10  GD32F303CBT6  [LQFP-48_L7.0-W7.0-P0.50-LS9.0-BL]  52.45 25.15 270 top
U11  WT588D-20SS  [SSOP-20_L7.2-W5.3-P0.65-LS7.8-BL]  75.56 23.7 0 top
U12  W25Q32JVSSIQ  [SOIC-8_L5.3-W5.3-P1.27-LS8.0-BL]  90.68 24 90 top
U13  BCON  [SOP_BCON]  12.83 12.45 90 top
U15  SL6206-33MR  [SOT-23-5_L2.9-W1.6-P0.95-LS2.8-BL]  19.18 10.16 0 top
U16  M24C02-WMN6TP  [SOIC-8_L4.9-W3.9-P1.27-LS6.0-BL]  24.38 34.92 270 top
USB1  -  [USB_TYPE-C-16P]  5 24 270 top
X1  32.768kHz  [FC-135R_L3.2-W1.5]  41.15 26.59 270 top

## Footprints (pads in the part's own frame, mm; a bottom-side part is the same pattern mirrored in y, then rotated)
AO3401A_SOT-23-3
  rect 1x0.8 smd: 1(1.15,-0.95) 2(1.15,0.95) 3(-1.15,0)
BAT-SMD_BS-12-B3AA011
  rect 3.75x2.8 smd: 1(7.75,0)
  rect 4.4x2.8 smd: 2(-7.75,0)
C0805
  rect 1.41x1.35 smd: 1(-1,0) 2(1,0)
C1206
  rect 1.485x1.728 smd: 1(-1.593,0) 2(1.593,0)
CONN-TH_2P-P2.50_HX25003-2A
  rect 1.8x1.8 hole 1.1: 1(-1.25,0)
  round 1.8 hole 1.1: 2(1.25,0)
DFN-6_L2.4-W2.4-P0.80-TL-EP
  rect 0.585x0.448 smd: 1(-1.137,0.8) 2(-1.137,0) 3(-1.137,-0.8) 4(1.137,-0.8) 5(1.137,0) 6(1.137,0.8)
  rect 1.25x1.65 smd: 7(0,0)
DFN-6_L3.0-W3.0-P0.95-TR-EP
  rect 0.5x0.75 smd: 1(0.95,1.452) 2(0,1.451) 3(-0.95,1.45) 4(-0.95,-1.452) 5(0,-1.452) 6(0.95,-1.451)
  rect 2.3x1.5 smd: 7(0.004,-0.001)
FC-135R_L3.2-W1.5
  rect 1x1.8 smd: 1(-1.25,0) 2(1.25,0)
HDR-TH_3P-P2.54-V-M-A
  rect 1.7x1.7 hole 1.1: 1(-2.54,0)
  round 1.7 hole 1.1: 2(0,0) 3(2.54,0)
HDR-TH_4P-P2.54-V-F
  rect 1.7x1.7 hole 1.1: 1(-3.81,0)
  round 1.7 hole 1.1: 2(-1.27,0) 3(1.27,0) 4(3.81,0)
HDR-TH_6P-P2.54-V-F
  rect 1.8x1.6 hole 1.02: 1(-6.35,0)
  round 1.6 hole 1.02: 2(-3.81,0) 3(-1.27,0) 4(1.27,0) 5(3.81,0) 6(6.35,0)
Key_SMD_12x12x7.3
  rect 2.999x1.999 smd: 1(-7.5,-2.499) 2(7.5,-2.499) 3(7.5,2.499) 4(-7.5,2.499)
LED-SEG-TH_FJ5461AH
  round 1.55 hole 0.9: 1(-6.35,-7.62) 2(-3.81,-7.62) 3(-1.27,-7.62) 4(1.27,-7.62) 5(3.81,-7.62) 6(6.35,-7.62) 7(6.35,7.62) 8(3.81,7.62) 9(1.27,7.62) 10(-1.27,7.62) 11(-3.81,7.62) 12(-6.35,7.62)
LED-SMD_4P-L2.0-W1.3-BR
  rect 0.55x0.55 smd: 1(0.775,-0.4) 2(-0.775,-0.4) 3(0.775,0.4) 4(-0.775,0.4)
LED_0805
  rect 1x1.25 smd: 1(-1.15,0.005) 2(1.05,0.005)
LQFP-48_L7.0-W7.0-P0.50-LS9.0-BL
  oval 0.27x1.5 smd: 1(-2.75,-4.25) 2(-2.25,-4.25) 3(-1.75,-4.25) 4(-1.25,-4.25) 5(-0.75,-4.25) 6(-0.25,-4.25) 7(0.25,-4.25) 8(0.75,-4.25) 9(1.25,-4.25) 10(1.75,-4.25) 11(2.25,-4.25) 12(2.75,-4.25) 25(2.75,4.25) 26(2.25,4.25) 27(1.75,4.25) 28(1.25,4.25) 29(0.75,4.25) 30(0.25,4.25) 31(-0.25,4.25) 32(-0.75,4.25) 33(-1.25,4.25) 34(-1.75,4.25) 35(-2.25,4.25) 36(-2.75,4.25)
  oval 1.5x0.27 smd: 13(4.25,-2.75) 14(4.25,-2.25) 15(4.25,-1.75) 16(4.25,-1.25) 17(4.25,-0.75) 18(4.25,-0.25) 19(4.25,0.25) 20(4.25,0.75) 21(4.25,1.25) 22(4.25,1.75) 23(4.25,2.25) 24(4.25,2.75) 37(-4.25,2.75) 38(-4.25,2.25) 39(-4.25,1.75) 40(-4.25,1.25) 41(-4.25,0.75) 42(-4.25,0.25) 43(-4.25,-0.25) 44(-4.25,-0.75) 45(-4.25,-1.25) 46(-4.25,-1.75) 47(-4.25,-2.25) 48(-4.25,-2.75)
M2螺丝
  round 2 hole 2: 1(0,0)
QFN-24_L4.0-W4.0-P0.50-TL-EP2.6
  oval 0.8x0.28 smd: 1(-2,1.25) 2(-2,0.75) 3(-2,0.25) 4(-2,-0.25) 5(-2,-0.75) 6(-2,-1.25) 13(2,-1.25) 14(2,-0.75) 15(2,-0.25) 16(2,0.25) 17(2,0.75) 18(2,1.242)
  oval 0.28x0.8 smd: 7(-1.25,-2) 8(-0.75,-2) 9(-0.25,-2) 10(0.25,-2) 11(0.75,-2) 12(1.25,-2) 19(1.25,2) 20(0.75,2) 21(0.25,2) 22(-0.25,2) 23(-0.75,2) 24(-1.25,2)
  rect 2.7x2.7 smd: 25(0,-0.013)
R0805
  rect 1.133x1.377 smd: 1(-1,0) 2(1,0)
RES-TH_L5.1-W4.3-P3.40-D0.5
  round 1.524 hole 0.762: 1(0,1.7) 2(0,-1.7)
S8550P_SOT
  rect 1.25x0.701 smd: 1(1.292,-0.95) 2(1.292,0.95) 3(-1.208,0)
SOIC-8_L4.9-W3.9-P1.27-LS6.0-BL
  oval 0.588x2.045 smd: 1(-1.905,-2.772) 2(-0.635,-2.772) 3(0.635,-2.772) 4(1.905,-2.772) 5(1.905,2.772) 6(0.635,2.772) 7(-0.635,2.772) 8(-1.905,2.772)
SOIC-8_L5.3-W5.3-P1.27-LS8.0-BL
  oval 0.63x2.25 smd: 1(-1.905,-3.53) 2(-0.635,-3.53) 3(0.635,-3.53) 4(1.905,-3.53) 5(1.905,3.53) 6(0.635,3.53) 7(-0.635,3.53) 8(-1.905,3.53)
SOP_BCON
  oval 1.2x0.5 smd: 1(-1,-0.7) 2(-1,-1.6) 3(-1,-2.5) 4(1,-2.5) 5(1,-0.7)
SOT-23-5_L2.9-W1.6-P0.95-LS2.8-BL
  rect 0.6x1 smd: 1(-0.95,-1.1) 2(0,-1.1) 3(0.95,-1.1) 4(0.95,1.1) 5(-0.95,1.1)
SPK-TH_BD23.0-P10.00-D0.8-L-RD
  rect 2.5x2.5 hole 1.1: 1(-5,0)
  round 2.5 hole 1.1: 2(5,0)
SSOP-20_L7.2-W5.3-P0.65-LS7.8-BL
  oval 0.364x2.082 smd: 1(-2.925,-3.491) 2(-2.275,-3.491) 3(-1.625,-3.491) 4(-0.975,-3.491) 5(-0.325,-3.491) 6(0.325,-3.491) 7(0.975,-3.491) 8(1.625,-3.491) 9(2.275,-3.491) 10(2.925,-3.491) 11(2.925,3.491) 12(2.275,3.491) 13(1.625,3.491) 14(0.975,3.491) 15(0.325,3.491) 16(-0.325,3.491) 17(-0.975,3.491) 18(-1.625,3.491) 19(-2.275,3.491) 20(-2.925,3.491)
USB_TYPE-C-16P
  oval 1.2x2 hole 0.7x1.7: 1(-4.193,1.765) 2(4.447,1.765)
  oval 1.2x1.8 hole 0.7x1.4: 3(-4.193,-2.415) 4(4.447,-2.415)
  rect 0.3x1.3 smd: A1(-3.223,2.415) A4(-2.423,2.415) A5(-1.123,2.415) A6(-0.123,2.415) A7(0.377,2.415) A8(1.377,2.415) A9(2.677,2.415) A12(3.477,2.415) B1(3.177,2.415) B4(2.377,2.415) B5(1.877,2.415) B6(0.877,2.415) B7(-0.623,2.415) B8(-1.623,2.415) B9(-2.123,2.415) B12(-2.923,2.415)

## Nets
As in the schematic.

Pads without a net: U3 1 10 11 12 13 14 15 16 17 18 19 22 23 24; U5 3 4; U6 4; U10 2 5 6; U11 6 20; U15 4; USB1 A8 B8

## Via types
v1: diameter 0.635, hole 0.381, Top Layer to Bottom Layer, 262 vias

## Routing (per net, layer and track width the routed paths; a pad name or vN(x,y) marks a point on that pad's centre or on a via; arc(x,y) is an arc through that point)
+3V3: length 455.4
  Top Layer w0.254: C28.1 49.7,31.08 U10.48 ; U11.17 74.56,27.16 v1(74.56,25.68) ; 59.25,28.52 C31.2 58.77,27.9 U10.36 ; U11.5 75.24,18.97 75.46,18.75 78.21,18.75 78.49,19.03 U11.10 79,20.72 C4.2 ; C29.2 56.46,20.9 U10.24
  Top Layer w0.762: v1(31.57,30.61) 31.56,30.6 R29.2 ; U12.7 U12.8 85.77,20.72 C6.2 C5.2 ; v1(46.75,12.39) 46.75,14.6 R15.1 ; R14.1 28.36,14.59 v1(28.36,12.34) ; C29.2 v1(56.78,12.4) ; C28.1 49.13,31.07 v1(48.27,30.21) ; C4.2 C5.2 ; C5.2 82.5,20.67 v1(82.5,19.46) ; v1(64.99,12.39) 64.99,14.54 R16.1 ; R30.2 29.8,36.58 v1(31.6,36.58) ; v1(63.7,41.07) 63.7,39.41 Q3.2 ; v1(94.92,28.04) 94.87,27.99 C7.1 ; v1(69.09,16.18) 69.1,16.19 R23.2 ; v1(68.33,41.07) 68.35,41.05 Q2.2 ; v1(38.18,18.9) 38.21,18.93 C30.1 42.86,18.93 R13.1 ; R31.1 5.39,42.25 Q5.2 3.41,45.05 H3.3 ; v1(73.18,41.07) 73.18,39.38 Q1.2 ; v1(83.31,12.39) 83.31,14.59 R17.1 ; R12.2 78.79,31.51 v1(78.79,35.05) ; v1(11.38,22.07) 11.39,22.08 C19.2 ; v1(58.8,41.1) 58.82,41.08 Q4.2
  Bottom Layer w0.762: 30.6,46.28 31.6,45.28 ; 30.6,46.28 H3.3 ; 30.6,46.28 31.6,46.28 ; 31.6,45.28 31.6,46.28 32.6,46.28 ; 31.6,45.28 31.6,45.28 32.6,46.28 ; 31.6,45.28 v1(31.6,36.58) 31.57,36.55 v1(31.57,30.61) 31.57,26.35 ; 96.43,12.39 96.43,12.41 95.5,13.34 ; 96.43,12.39 98.22,12.39 H2.2 ; 96.43,12.39 95.51,12.39 ; 73.18,46.28 73.18,45.51 ; 73.18,46.28 72.41,46.28 ; 73.18,46.28 74.07,46.28 ; 73.18,45.51 73.3,45.51 74.07,46.28 ; 73.18,45.51 72.41,46.28 ; 73.18,45.51 v1(73.18,41.07) ; 31.57,26.35 31.57,26.04 R34.1 31.68,25.58 30.8,25.58 ; 31.57,26.35 30.8,25.58 ; 32.6,46.28 58.03,46.28 ; 67.48,46.28 64.5,46.28 ; 67.48,46.28 68.33,45.43 ; 67.48,46.28 72.41,46.28 ; 64.5,46.28 63.7,45.49 ; 64.5,46.28 63.71,46.28 ; 58.8,45.5 58.03,46.28 ; 58.8,45.5 58.8,46.26 58.78,46.28 ; 58.8,45.5 v1(58.8,41.1) 57.99,40.28 v1(57.99,28.5) ; 58.8,45.5 59.58,46.28 ; 58.03,46.28 58.78,46.28 ; 69.09,13.14 69.83,12.39 ; 69.09,13.14 v1(69.09,16.18) ; 69.09,13.14 69.09,12.4 ; 69.09,13.14 69.03,13.14 68.29,12.39 ; 69.83,12.39 69.09,12.39 ; 69.83,12.39 v1(83.31,12.39) 94.56,12.39 ; 25.51,17.65 26.28,18.43 ; 25.51,17.65 26.28,17.65 26.28,17.65 ; 25.51,17.65 v1(18.58,17.65) v1(17.83,17.65) 11.79,17.65 11.38,18.06 v1(11.38,22.07) ; 25.51,17.65 26.26,16.9 26.28,16.9 ; 26.28,18.43 26.28,20.84 ; 26.28,18.43 26.28,17.65 ; 26.26,14.42 26.26,14.4 ; 26.26,14.42 26.26,16.88 26.28,16.9 ; 26.26,14.42 26.26,12.98 26.9,12.34 v1(28.36,12.34) 37.39,12.34 ; 26.85,21.67 26.85,21.41 26.28,20.84 26.28,22.2 26.32,22.2 26.85,21.67 ; 26.85,21.67 47.62,21.67 48.27,22.31 v1(48.27,30.21) ; 37.39,12.34 38.08,12.34 ; 37.39,12.34 38.12,13.08 38.18,13.08 ; 38.08,12.34 38.9,12.34 ; 38.08,12.34 38.18,12.44 38.18,13.08 ; 68.29,12.39 v1(64.99,12.39) v1(56.78,12.39) v1(46.75,12.39) 46.7,12.34 38.9,12.34 ; 68.29,12.39 69.09,12.39 ; v1(63.7,41.07) 63.7,45.49 ; 63.7,45.49 63.7,46.27 63.71,46.28 ; 63.71,46.28 62.93,46.28 ; 62.93,46.28 62.93,46.14 63.42,45.64 ; 62.93,46.28 59.58,46.28 ; 79.81,35.05 v1(78.79,35.05) 78.79,36.07 ; 79.81,35.05 89.03,35.05 89.64,34.44 89.64,32.23 90.14,31.72 94.13,31.72 ; 79.81,35.05 78.79,36.07 ; v1(74.56,25.68) 74.29,25.41 74.29,20.02 74.83,19.48 82.47,19.48 v1(82.5,19.46) 82.52,19.43 94.87,19.43 95.5,18.8 95.5,13.34 ; 68.33,45.43 69.17,46.28 ; 68.33,45.43 68.33,46.23 ; 68.33,45.43 v1(68.33,41.07) ; 26.28,22.23 26.28,24.68 27.18,25.58 30.8,25.58 ; 94.9,31.72 95.63,31.72 ; 94.9,31.72 94.13,31.72 ; 94.9,31.72 94.92,31.7 94.92,31.02 ; 95.63,31.72 98.27,31.72 H1.5 ; 95.63,31.72 94.92,31.02 ; 38.9,12.34 38.9,12.36 38.18,13.08 ; 38.18,13.08 v1(38.18,18.9) ; 95.5,13.34 94.56,12.39 ; 95.5,13.34 95.5,12.41 95.51,12.39 ; 94.56,12.39 95.51,12.39 ; 74.07,46.28 78.21,46.28 78.79,45.69 78.79,36.07 ; 94.13,31.72 94.84,31.02 94.92,31.02 ; 94.92,31.02 v1(94.92,28.04) ; 26.28,16.9 26.28,17.65 ; 59.58,46.28 58.78,46.28
GND: length 135.8
  Top Layer w0.254: U10.47 50.2,27.32 v1(50.39,27.13) ; U11.19 73.26,27.19 73.25,27.18 73.25,25.29 73.51,25.03 75.13,25.03 75.15,25.04 75.64,25.04 75.86,25.27 75.86,27.16 U11.15 ; U10.23 v1(54.7,19.67) ; U10.35 55.41,27.4 55.27,27.25 55.27,26.7 55.08,26.5 54.64,26.5 54.36,26.23 v1(54.36,25.88) ; C13.2 9.84,9.86 10.13,10.16 12.29,10.16 12.63,10.49 12.63,11.45 ; v1(12.9,25.15) 13.42,24.63 U3.2 15.87,24.63 U3.25 ; 6.88,37.94 U6.7
  Top Layer w0.508: v1(46.93,27.54) v1(45.78,27.54) 44.85,27.54 v1(44.68,27.71) v1(44.68,28.64) 44.68,29.25 44.17,29.75 C20.1 v1(42.03,29.75) v1(41.16,29.75) 40.32,29.75 v1(40.29,29.72) 40.29,29.62 v1(39.73,29.06) 39.52,28.85 v1(39.52,28.16) v1(39.52,27.11) v1(39.52,26.04) v1(39.52,24.9) 39.52,24.28 v1(39.7,24.1) v1(40.29,23.51) 40.31,23.5 v1(41.13,23.5) 41.91,23.5 v1(41.93,23.51) 43.23,23.51 C21.1 44.06,23.44 44.65,24.03 v1(44.65,24.61) v1(44.65,25.45) 44.95,25.75 v1(45.76,25.75) v1(46.93,25.75)
  Top Layer w0.762: USB1.A12 7.42,20.2 USB1.2 6.77,17.7 R10.1 ; C9.2 v1(54.91,14.61) ; C10.2 v1(73.28,14.62) ; R11.2 82.96,31.61 C1.2 ; R35.2 33.19,19.7 v1(33.17,19.69) ; C13.2 10.31,7.91 CN1.2 ; C8.2 36.42,14.61 v1(36.45,14.58) ; R18.2 6.66,13.11 v1(6.63,13.13) ; v1(45.66,31.78) 47.01,31.78 C28.2 ; C29.1 v1(60.58,20.57) ; v1(23.19,13.69) 23.17,13.72 C17.1 21.4,15.28 C18.1 ; C11.2 v1(91.44,14.61) ; C23.2 22.1,38.86 21.61,38.38 U16.1 U16.2 ; C31.1 v1(63.3,28.45) ; USB1.4 1.91,18.87 R20.1 ; C24.1 17.37,37.02 v1(17.37,35) v1(17.37,34.19) 17.22,34.04 14.86,34.04 14.78,34.11 v1(11.66,34.11) 11.65,34.11 C26.1 ; R9.1 6.77,30.05 USB1.1 7.42,27.54 7.42,27.16 ; U16.4 U16.3 U16.2 ; U6.7 8.08,36.81 8.5,36.38 10.9,36.38 11.44,36.92 C25.1 11.44,39.98 C27.1 ; U16.2 U16.7 ; C14.2 12.95,17.71 C19.1 v1(14.48,20.08) ; C4.1 C5.1 C6.1 84.71,24.41 v1(84.68,24.44) ; C2.2 v1(76.61,34.92)
  vias: v1(0.97,30.89) v1(0.97,30.01) v1(1.79,30.89) v1(1.79,30.01) v1(4.42,56.03) v1(4.42,55.16) v1(4.39,37.19) v1(4.39,36.49) v1(5.08,37.18) v1(5.08,36.49) v1(5.11,3.78) v1(5.08,2.96) v1(5.25,56.03) v1(5.25,55.16) v1(5.93,3.78) v1(5.96,2.96) v1(10.59,27.13) v1(10.59,26.25) v1(11.42,27.13) v1(11.42,26.25) v1(15.29,10.77) v1(15.29,9.89) v1(16.12,10.77) v1(16.12,9.89) v1(19.96,43.15) v1(19.96,42.28) v1(20.79,43.15) v1(20.79,42.28) v1(22.1,58.06) v1(22.1,57.19) v1(22.3,22.94) v1(22.3,22.06) v1(22.92,58.06) v1(22.92,57.19) v1(23.13,22.94) v1(23.13,22.06) v1(23.14,1.93) v1(23.14,1.05) v1(23.52,15.55) v1(23.52,14.67) v1(23.96,1.93) v1(23.96,1.05) v1(24.35,15.55) v1(24.35,14.67) v1(26.92,43.08) v1(26.92,42.2) v1(27.75,43.08) v1(27.75,42.2) v1(30.96,3.79) v1(30.96,2.92) v1(31.79,3.79) v1(31.79,2.92) v1(32.03,58.09) v1(32.03,57.21) v1(32.85,58.09) v1(32.85,57.21) v1(36.83,28.7) v1(36.83,27.83) v1(37.66,28.7) v1(37.66,27.83) v1(38.3,58.09) v1(38.3,57.21) v1(38.3,50.8) v1(38.3,49.92) v1(39.13,58.09) v1(39.13,57.21) v1(39.13,50.8) v1(39.13,49.92) v1(40.11,2.01) v1(40.11,1.13) v1(40.93,2.01) v1(40.93,1.13) v1(44.43,23.81) v1(44.49,29.44) v1(47.65,34.98) v1(49.38,3.67) v1(49.38,2.79) v1(50.2,3.67) v1(50.2,2.79) v1(58.53,2.21) v1(58.53,1.33) v1(59.36,2.21) v1(59.36,1.33) v1(59.54,15.21) v1(59.54,14.34) v1(60.36,15.21) v1(60.36,14.34) v1(63.17,51.05) v1(63.17,50.18) v1(64,51.05) v1(64,50.18) v1(64.78,32.77) v1(64.78,31.97) v1(67.67,3.75) v1(67.67,2.88) v1(68.3,32.92) v1(68.3,32.04) v1(68.49,3.75) v1(68.49,2.88) v1(69.13,32.92) v1(69.13,32.04) v1(72.18,32.92) v1(72.18,32.05) v1(73.01,32.92) v1(73.01,32.05) v1(76.2,15.39) v1(76.2,14.52) v1(76.84,2.01) v1(76.84,1.13) v1(77.03,15.39) v1(77.03,14.52) v1(77.19,57.78) v1(77.19,56.91) v1(77.66,2.01) v1(77.66,1.13) v1(78.02,57.78) v1(78.02,56.91) v1(78.38,15.39) v1(78.38,14.52) v1(79.21,15.39) v1(79.21,14.52) v1(85.83,33.07) v1(85.83,32.19) v1(85.95,3.75) v1(85.95,2.88) v1(86.65,33.07) v1(86.65,32.19) v1(86.78,3.75) v1(86.78,2.88) v1(91.64,16.15) v1(92.39,16.15) v1(93.37,35.08) v1(93.37,34.2) v1(94.2,35.08) v1(94.2,34.2) v1(97.84,38.76) v1(97.84,37.88) v1(98.67,38.76) v1(98.67,37.88)
VBUS: length 9.5
  Top Layer w0.254: USB1.A4 7.1,26.1 6.63,26.1 6.44,25.91 ; 6.44,25.91 v1(5.74,25.91)
  Bottom Layer w0.508: v1(9.3,21.44) 8.92,21.82 6.07,21.82 5.74,22.15 v1(5.74,25.91)
+VS: length 22
  Top Layer w0.508: v1(1.12,43.36) 1.12,41.31 Q5.3 v1(1.11,34.47) 1.11,33.8 v1(1.09,33.78) ; 15.51,37.08 14.86,36.43 U5.5 ; 11.47,42.11 R28.1
  Bottom Layer w0.508: v1(11.64,43.32) 11.6,43.36 v1(1.12,43.36)
  vias: v1(4.78,34.44) v1(4.78,33.76) v1(5.5,34.44) v1(5.5,33.76) v1(12.8,43.29) v1(12.8,42.57) v1(12.83,41.81) v1(14.99,38.33) v1(15.69,38.33)
AM_BUSY: length 24.5
  Top Layer w0.254: v1(78.46,24.44) 78.46,25.86 78.49,25.89 U11.11 ; U10.29 v1(75.44,24.4)
  Bottom Layer w0.254: v1(75.44,24.4) 78.42,24.4 v1(78.46,24.44)
AM_CLK: length 22.8
  Top Layer w0.254: 77.84,20.77 77.84,22.06 77.04,22.86 56.74,22.86 U10.26
AM_CS: length 21.9
  Top Layer w0.254: U10.25 56.71,22.39 76.86,22.39 77.19,22.06 77.19,20.77
AM_DAT: length 25.4
  Top Layer w0.254: U10.28 55.8,23.9 55.55,23.65 55.55,22.13 55.75,21.93 76.19,21.93 76.54,21.58 U11.7
AM_RST: length 28.2
  Top Layer w0.254: 76.57,29.57 C2.1 78.44,29.61 78.57,29.48 R12.1 ; U10.27 76.1,23.4 76.56,23.85 76.56,25.88 76.54,25.89 U11.14 ; 76.57,26.88 76.57,29.46
COM1: length 24.6
  Top Layer w0.254: R24.1 71.09,25.44 70.54,24.9 U10.30
COM2: length 19.2
  Top Layer w0.254: R25.1 66.24,34.5 66.22,34.47 66.22,25.96 65.66,25.4 U10.31
COM3: length 18.5
  Top Layer w0.254: U10.32 55.23,25.9 v1(55.19,25.86) ; v1(61.61,33.91) 61.53,33.98 R26.1
  Bottom Layer w0.254: v1(55.19,25.86) 55.19,25.43 55.47,25.15 61.14,25.15 61.61,25.62 v1(61.61,33.91)
COM4: length 11.5
  Top Layer w0.254: R27.1 56.79,34.5 56.79,34.49 v1(56.79,33.4) ; v1(57.99,26.25) 57.84,26.4 U10.33
  Bottom Layer w0.254: v1(57.99,26.25) 57.16,26.25 56.79,26.62 v1(56.79,33.4)
I2C_SCL: length 61.7
  Top Layer w0.254: 7.68,35.67 13.73,35.67 U5.6 13.91,39.13 14.2,39.42 19.2,39.42 19.46,39.17 19.46,31.75 19.66,31.55 25.37,31.55 25.63,31.8 25.63,33.98 25.93,34.29 U16.6 29.35,34.29 R30.1 30.14,34.24 30.51,34.24 31.32,33.43 50.62,33.43 51.16,32.89 51.16,30.59 51.16,30.59 U10.45
I2C_SDA: length 61.4
  Top Layer w0.254: U10.46 50.7,30.4 50.7,30.4 50.7,32.61 50.34,32.97 30.09,32.97 R29.1 29.3,33.02 U16.5 27.18,33 27.18,31.44 26.82,31.09 14.12,31.09 13.91,31.3 13.91,32.49 3.89,32.49 3.63,32.74 3.63,37.72 3.86,37.94 6.08,37.94
KEY1: length 47.7
  Top Layer w0.254: SW1.2 29.86,10 30.35,10.49 30.35,13.65 30.34,13.66 R14.2 C8.1 ; U10.10 48.17,23.36 46.83,23.36 46.51,23.04 46.51,18.46 v1(46.47,18.43) ; v1(46.51,16.61) 33.02,16.61 32.53,16.12 C8.1 ; C8.1 32.53,13.68 32.54,13.67 32.54,10.41 32.95,10 SW1.1
  Bottom Layer w0.254: v1(46.51,16.61) 46.47,16.65 v1(46.47,18.43)
KEY2: length 36.2
  Top Layer w0.254: C9.1 R15.2 48.75,13.66 48.84,13.57 48.84,10.64 48.2,10 SW2.2 ; C9.1 50.82,10.63 51.44,10 SW2.1 ; C9.1 v1(50.82,16.26) ; U10.11 48.17,22.86 47.39,22.86 47.12,22.59 47.12,18.97 v1(47.15,18.93)
  Bottom Layer w0.254: v1(50.82,16.26) 50.76,16.31 47.47,16.31 47.15,16.62 v1(47.15,18.93)
KEY3: length 50.6
  Top Layer w0.254: R16.2 67.06,16.26 v1(67.13,16.33) ; R16.2 67.06,10.62 66.44,10 SW3.2 ; R16.2 69.15,14.61 C10.1 69.17,10.64 69.81,10 SW3.1 ; v1(47.84,18.43) 47.84,22.36 47.87,22.4 U10.12
  Bottom Layer w0.254: v1(47.84,18.43) 47.84,17.16 48.09,16.9 66.74,16.9 67.13,16.51 v1(67.13,16.33)
KEY4: length 67.3
  Top Layer w0.254: v1(49.37,19.19) 49.7,19.53 U10.13 ; C11.1 87.39,10.63 88.02,10 SW4.1 ; C11.1 87.39,16.09 v1(87.45,16.15) ; C11.1 R17.2 85.33,10.6 84.73,10 SW4.2
  Bottom Layer w0.254: v1(49.37,19.19) 49.37,17.77 49.77,17.36 67.12,17.36 67.56,16.92 87.12,16.92 87.45,16.59 v1(87.45,16.15)
LED1: length 16.3
  Top Layer w0.254: v1(63.6,18.29) 63.71,18.4 LED2.1 ; U10.15 50.7,19.49 v1(51.04,19.15)
  Bottom Layer w0.254: v1(51.04,19.15) 51.04,18.61 51.54,18.11 63.42,18.11 v1(63.6,18.29)
LED2: length 16.5
  Top Layer w0.254: v1(51.83,18.76) 51.79,18.8 51.79,19.36 51.2,19.95 U10.16 ; v1(62.69,19.96) 64.57,19.96 LED2.2
  Bottom Layer w0.254: v1(51.83,18.76) 52.02,18.57 62.41,18.57 62.69,18.85 v1(62.69,19.96)
LED3: length 17.9
  Top Layer w0.254: LED2.4 65.41,19.96 v1(65.41,21.03) ; 51.74,20.86 U10.17 51.7,20.1 52.25,19.55 52.25,19.54 v1(52.58,19.22)
  Bottom Layer w0.254: v1(65.41,21.03) 62.23,21.03 62,20.8 62,19.2 61.82,19.02 52.77,19.02 v1(52.58,19.22)
PWR_EN: length 73.4
  Top Layer w0.254: R31.2 3.46,40.3 Q5.1 3.13,40.07 3.13,32.25 3.46,31.92 9.41,31.92 9.78,31.55 9.78,29.34 9.96,29.16 32.28,29.16 32.51,29.39 32.51,30.91 32.74,31.14 45.06,31.14 45.52,30.68 45.52,29.41 45.77,29.16 48.66,29.16 49.28,28.54 49.28,26.31 49.68,25.91 53.29,25.91 53.47,26.09 53.47,26.72 53.62,26.87 54.36,26.87 54.68,27.19 54.68,29.37 U10.38
RES_PHOTO: length 23.9
  Top Layer w0.254: R34.2 35.25,22.14 R35.1 35.2,22.06 v1(35.2,20.55) ; v1(50.2,18.78) 50.2,18.79 U10.14
  Bottom Layer w0.254: v1(35.2,20.55) 49.82,20.55 50,20.37 50,19.32 ; v1(50.2,18.78) 50.2,19.11 50.01,19.3
RXD: length 49.1
  Top Layer w0.254: U10.21 53.7,17.86 53.1,17.26 29.47,17.26 29.22,17.52 29.22,26.15 28.77,26.61 17.69,26.61 17.39,26.3 U3.20
SEGA: length 32.8
  Top Layer w0.254: v1(51.94,22.25) 52.2,21.99 U10.18 ; R1.1 v1(35.18,35.23)
  Bottom Layer w0.254: v1(51.94,22.25) 49.38,22.25 48.98,22.64 48.98,33.41 48.67,33.73 35.38,33.73 34.98,34.14 34.98,35.2 35,35.23 v1(35.18,35.23)
SEGB: length 27.5
  Top Layer w0.254: U10.19 52.7,22.67 v1(52.65,22.72) ; R2.1 v1(40.89,35.23)
  Bottom Layer w0.254: v1(40.89,35.23) 40.84,35.23 40.68,35.06 40.68,34.76 41.25,34.19 49.16,34.19 49.44,33.91 49.44,23.28 49.85,22.87 51.65,22.87 51.67,22.9 52.21,22.9 52.41,22.69 52.63,22.69 v1(52.65,22.72)
SEGC: length 17.9
  Top Layer w0.254: U10.20 53.2,22.08 v1(53.39,22.27) ; R3.1 v1(51.24,35.23)
  Bottom Layer w0.254: v1(51.24,35.23) 51.28,35.19 51.28,23.85 51.7,23.43 52.86,23.43 53.39,22.9 v1(53.39,22.27)
SEGD: length 16.5
  Top Layer w0.254: R4.1 46.23,35.21 v1(46.23,35.2) ; v1(54.2,31.01) 54.2,31.01 U10.39
  Bottom Layer w0.254: v1(46.23,35.2) 46.94,35.92 53.82,35.92 54.2,35.53 v1(54.2,31.01)
SEGDP: length 10.9
  Top Layer w0.254: U10.43 52.2,30.4 52.22,30.42 52.22,34.34 51.98,34.58 49.02,34.58 48.77,34.84 R8.1
SEGE: length 25.5
  Top Layer w0.254: R5.1 43.66,37.08 v1(43.66,35.15) ; v1(53.85,27.71) 53.7,27.86 U10.40
  Bottom Layer w0.254: v1(53.85,27.71) 54.03,27.89 54.84,27.89 55.04,28.09 55.04,36.02 54.67,36.39 44.11,36.39 43.99,36.27 43.99,35.41 43.74,35.15 v1(43.66,35.15)
SEGF: length 34.5
  Top Layer w0.254: v1(38.05,35.23) 38.1,35.28 R6.1 ; U10.41 53.2,27.41 v1(53.08,27.29)
  Bottom Layer w0.254: v1(38.05,35.23) 38.16,35.34 38.16,36.08 38.72,36.64 40.65,36.64 40.86,36.84 55.11,36.84 55.5,36.45 55.5,27.43 55.14,27.08 54.13,27.08 54.12,27.06 53.58,27.06 53.57,27.08 53.43,27.08 53.2,27.31 53.09,27.31 v1(53.08,27.29)
SEGG: length 8.5
  Top Layer w0.254: R7.1 53.8,34.83 53.54,34.57 52.91,34.57 52.7,34.36 U10.42
SPI_CS_AM: length 29.8
  Top Layer w0.254: v1(94.16,18.49) 94.16,22.05 U12.1 97.79,22.1 H1.1 ; U11.3 73.94,20.2 v1(73.94,18.59)
  Bottom Layer w0.254: v1(94.16,18.49) 94.16,18.52 94.13,18.54 93.8,18.54 93.78,18.52 74.04,18.52 73.96,18.59 v1(73.94,18.59)
SPI_MISO: length 34.3
  Top Layer w0.254: U11.1 72.64,17.66 72.99,17.31 92.24,17.31 92.74,17.81 92.74,23.11 93.01,23.39 94.18,23.39 U12.2 97.54,23.37 H1.2
SPI_MOSI: length 43.1
  Top Layer w0.254: H1.4 87.45,29.21 87.15,28.91 87.15,28.65 ; U11.2 73.29,18.15 73.67,17.77 89.34,17.77 89.74,18.16 89.74,25.4 89.31,25.83 87.22,25.83 U12.5 87.15,28.65
SPI_SCK: length 49
  Top Layer w0.254: H1.3 99.09,26.67 99.43,27.01 99.43,29.73 98.82,30.34 85.95,30.34 85.69,30.09 85.69,24.89 85.95,24.64 U12.6 88.77,24.64 89.28,24.13 89.28,19.09 88.42,18.22 75.09,18.22 74.59,18.73 U11.4
TXD: length 54.9
  Top Layer w0.254: U10.22 54.2,23.19 53.65,23.75 51.28,23.75 50.93,23.39 50.93,22.4 50.55,22.02 49.12,22.02 48.72,21.62 48.72,18.06 48.44,17.78 29.97,17.78 29.72,18.03 29.72,26.52 29.17,27.06 17.18,27.06 16.89,26.77 16.89,25.75
USB_DN: length 15.2
  Top Layer w0.254: 7.42,23.62 4.28,23.62 3.9,24 3.9,24.54 4.28,24.92 4.82,24.92 5.09,24.64 7.4,24.64 USB1.B7 ; USB1.A7 13.63,23.62 13.64,23.63 U3.4
USB_DP: length 15.2
  Top Layer w0.254: USB1.B6 4.01,23.12 4.01,23.12 3.95,23.12 3.93,23.1 v1(3.93,23.02) ; v1(4.55,24.27) 4.69,24.12 USB1.A6 13.98,24.12 13.98,24.13 U3.3
  Bottom Layer w0.254: v1(3.93,23.02) 3.93,23.65 v1(4.55,24.27)
$1N1449: length 28.4
  Top Layer w0.254: DS1.8 53.81,58.47 54.06,58.72 60.63,58.72 61.07,58.28 Q3.3
$1N1467: length 3.3
  Top Layer w0.254: R5.2 43.65,39.12 DS1.1
$1N1471: length 3.3
  Top Layer w0.254: DS1.2 46.23,42.34 R4.2
$1N1475: length 3.3
  Top Layer w0.254: DS1.3 48.77,42.34 R8.2
$1N1479: length 3.3
  Top Layer w0.254: DS1.4 51.24,42.35 R3.2
$1N1483: length 3.3
  Top Layer w0.254: DS1.5 53.81,39.11 R7.2
$1N1487: length 28.8
  Top Layer w0.254: R1.2 35.18,44.91 35.62,45.35 45.43,45.35 46.11,46.04 46.11,57.54 DS1.11
$1N1491: length 33.3
  Top Layer w0.254: DS1.7 56.35,44.97 55.77,44.39 41.49,44.39 40.89,43.79 R2.2
$1N1495: length 28.4
  Top Layer w0.254: R6.2 38.3,39.31 38.3,44.45 38.7,44.84 48.13,44.84 48.73,45.44 DS1.10
$1N6161: length 5.4
  Top Layer w0.254: 77.89,28.39 77.89,28.11 ; 77.89,28.39 77.89,28.41 78.04,28.56 80.58,28.56 80.82,28.8 80.82,29.51 C1.1 ; 77.89,28.39 77.84,28.37 77.84,27.29
$1N6192: length 12.3
  Top Layer w0.254: v1(83.03,25.3) 83.08,25.35 83.08,29.3 ; 83.08,29.3 R11.1 ; 83.08,29.3 82.96,29.17 ; U11.13 77.19,25.21 v1(77.2,25.2)
  Bottom Layer w0.254: v1(83.03,25.3) 82.93,25.2 v1(77.2,25.2)
$1N6375: length 28.5
  Top Layer w0.254: U11.18 73.95,27.2 73.95,28.26 73.94,28.28 73.94,29.03 74.62,29.72 74.62,45.19 75.03,45.59 82.47,45.59 82.73,45.85 82.73,47.45 82.76,47.47 SPK1.1
$1N6384: length 38
  Top Layer w0.254: U11.16 75.24,44.61 75.74,45.11 92.38,45.11 92.63,45.36 92.63,47.03 92.23,47.43 92.23,47.46 92.4,47.62 SPK1.2
$1N6917: length 6.6
  Top Layer w0.254: 91.02,28.06 91.02,27.3 90.92,27.2 90.92,24.92 91.18,24.66 94.18,24.66 U12.3
$1N7212: length 7.8
  Top Layer w0.254: R13.2 45.17,19.08 45.72,19.08 46.05,19.41 46.05,23.6 46.35,23.9 U10.9
$1N7925: length 7.4
  Top Layer w0.254: U10.3 44.16,26.9 C20.2 43.22,27.84 X1.1
$1N7930: length 7.5
  Top Layer w0.254: U10.4 44.27,26.4 C21.2 41.41,25.44 41.32,25.34 X1.2
$1N8028: length 15.9
  Top Layer w0.254: R22.1 56.22,32.51 v1(56.15,32.44) ; U10.44 51.7,26.78 v1(51.93,26.56)
  Bottom Layer w0.254: v1(51.93,26.56) 51.98,26.61 55.77,26.61 56.15,26.99 v1(56.15,32.44)
$1N8104: length 1.8
  Top Layer w0.254: LED2.3 66.88,18.4 67.12,18.64
$1N8256: length 49.7
  Top Layer w0.254: DS1.12 43.65,59.3 43.99,59.64 69.98,59.64 70.62,58.99 Q1.3
$1N8335: length 36.5
  Top Layer w0.254: DS1.9 51.24,57.65 51.24,58.86 51.56,59.18 65.28,59.18 65.82,58.64 65.82,38.38 Q2.3
$1N8343: length 4
  Top Layer w0.254: DS1.6 56.35,38.38 Q4.3
$1N8477: length 2
  Top Layer w0.254: R24.2 73.12,35.5 Q1.1
$1N8481: length 2
  Top Layer w0.254: R25.2 68.35,35.54 Q2.1
$1N8485: length 2
  Top Layer w0.254: Q3.1 63.57,35.44 R26.2
$1N8489: length 2
  Top Layer w0.254: Q4.1 58.82,35.47 R27.2
$1N8598: length 6.7
  Top Layer w0.254: C22.2 44.86,21.04 45.47,21.64 45.47,24.54 45.83,24.9 U10.7
$1N9384: length 6
  Top Layer w0.254: R28.2 9.44,40.03 C27.2 9.44,39.98 C25.2 9.43,37.94 7.68,37.94
$1N9794: length 4.8
  Top Layer w0.254: R32.1 55.65,30.48 55.2,30.03 U10.37
$1N9795: length 58.8
  Top Layer w0.254: R32.2 v1(63.02,30.48)
  Bottom Layer w0.254: H2.1 99,9.78 99.53,10.31 99.53,18.66 99.19,19 97.49,19 97.08,19.41 97.08,26.92 96.67,27.33 64.97,27.33 64.58,27.72 64.58,30.14 64.24,30.48 v1(63.02,30.48)
$1N9824: length 2.7
  Top Layer w0.254: U10.34 58.72,26.9 R33.1
$1N9825: length 46.3
  Top Layer w0.254: R33.2 61.63,26.85 v1(62.89,26.85)
  Bottom Layer w0.254: v1(62.89,26.85) 62.92,26.87 96.27,26.87 96.62,26.52 96.62,17.78 97,17.4 H2.4
$1N10132: length 4.6
  Top Layer w0.762: BT1.1 6.65,51.36 H3.1
$1N10135: length 65.4
  Top Layer w0.254: v1(33.35,35.23) 33.35,48.08 32.68,48.76 2.25,48.76 H3.2 ; U10.1 47.57,27.9 v1(46.96,28.5)
  Bottom Layer w0.254: v1(33.35,35.23) 33.35,31.55 34.19,30.71 46.58,30.71 46.96,30.33 v1(46.96,28.5)
$2N394: length 7.4
  Top Layer w0.254: USB1.A5 7.39,25.14 5.24,25.14 4.72,25.66 R9.2
$2N397: length 6.9
  Top Layer w0.254: USB1.B5 5.26,22.12 4.72,21.58 R10.2
$2N1836: length 3.6
  Top Layer w0.254: R21.1 17.9,19.56 16.81,19.56 16.39,19.99 U3.9
$2N6275: length 2.9
  Top Layer w0.254: LED4.2 4.95,12.84 R19.2
$2N6277: length 2.9
  Top Layer w0.254: LED5.1 1.91,12.84 R20.2
$2N6369: length 13.1
  Top Layer w0.254: LED5.2 4.92,7.71 LED4.1 6.8,7.74 7.06,8 7.06,10.9 7.61,11.45 11.73,11.45
$2N6547: length 2
  Top Layer w0.254: 11.73,13.45 10.18,13.45 R18.1

## Copper pours and planes (outline as drawn; the poured copper is in the pictures)
+3V3 on Top Layer: 57.38,29.13 59.96,29.13 59.96,27.76 57.38,27.76
+3V3 on Top Layer: 24.71,39.57 30.43,39.57 30.43,36.12 24.71,36.12
+3V3 on Top Layer: 17.47,20.14 20.52,20.14 20.52,17.12 17.47,17.12
+3V3 on Top Layer: 17.45,17.2 18.95,17.2 18.95,10.72 17.45,10.72
+3V3 on Top Layer: 12.26,23.27 14.99,23.27 14.99,21.41 12.26,21.41
GND on Top Layer: -3.33,62.46 101.85,62.46 102.13,62.18 102.13,-1.68 102.41,-1.96 -1.52,-1.96 -3.33,-0.15
GND on Top Layer: 3.96,37.57 7.71,37.57 7.71,36.09 3.96,36.09
GND on Bottom Layer: -2.36,61.82 104.75,61.82 104.88,61.95 104.88,-2.59 105.44,-3.15 -1.8,-3.15 -2.77,-2.18 -2.77,61.42
VBAT on Top Layer: 13.74,6.68 18.92,6.68 18.92,1.75 13.74,1.75
VBAT on Top Layer: 18.25,9.53 20.45,9.53 20.45,7.49 18.25,7.49
VBAT on Top Layer: 11.99,9.04 13.74,9.04 13.74,1.76 11.99,1.76
VBAT on Top Layer: 12.31,11.97 13.74,11.97 13.74,7.57 12.31,7.57
VBAT on Top Layer: 17.42,9.47 18.87,9.47 18.87,6.59 17.42,6.59
VBUS on Top Layer: 4.3,18.36 10.44,18.36 10.44,14.43 4.3,14.43
VBUS on Top Layer: 9.83,22.18 16,22.18 16,14.43 9.83,14.43
VBUS on Top Layer: 12.99,14.43 14.07,14.43 14.07,12.87 12.99,12.87
VBUS on Top Layer: 6.81,21.74 10.44,21.74 10.44,16.81 6.81,16.81
+VS on Top Layer: 10.87,43.64 13.33,43.64 13.33,41.4 10.87,41.4
+VS on Top Layer: 4.37,35.94 7.7,35.94 7.7,33.43 4.37,33.43
+VS on Top Layer: 14.62,38.89 16.03,38.89 16.03,36.43 14.62,36.43
+VS on Bottom Layer: 12.39,43.64 16,43.64 16,37.66 12.39,37.66
+VS on Bottom Layer: 0.79,34.77 5.87,34.77 5.87,33.43 0.79,33.43

Small or netless copper shapes (teardrops, artwork), in the pictures only: 424 on Top Layer, 91 on Bottom Layer

## Text on the board
Top Silkscreen Layer: MOSI | CS | GND | 3V3 | SCK | MISO | VBAT | BT1 | PA14 | PA13
